# EasyEDA Pro project TI.epro

# Schematic Schematic6
Board Name: 28335底板; Create Date: 2026-03-09; Page Name: P1; Project Name: 最小系统板28335; Schematic Name: Schematic6; Update Date: 2026-07-10; Company: 嘉立创EDA; Page Size: A4; Version: V1.0
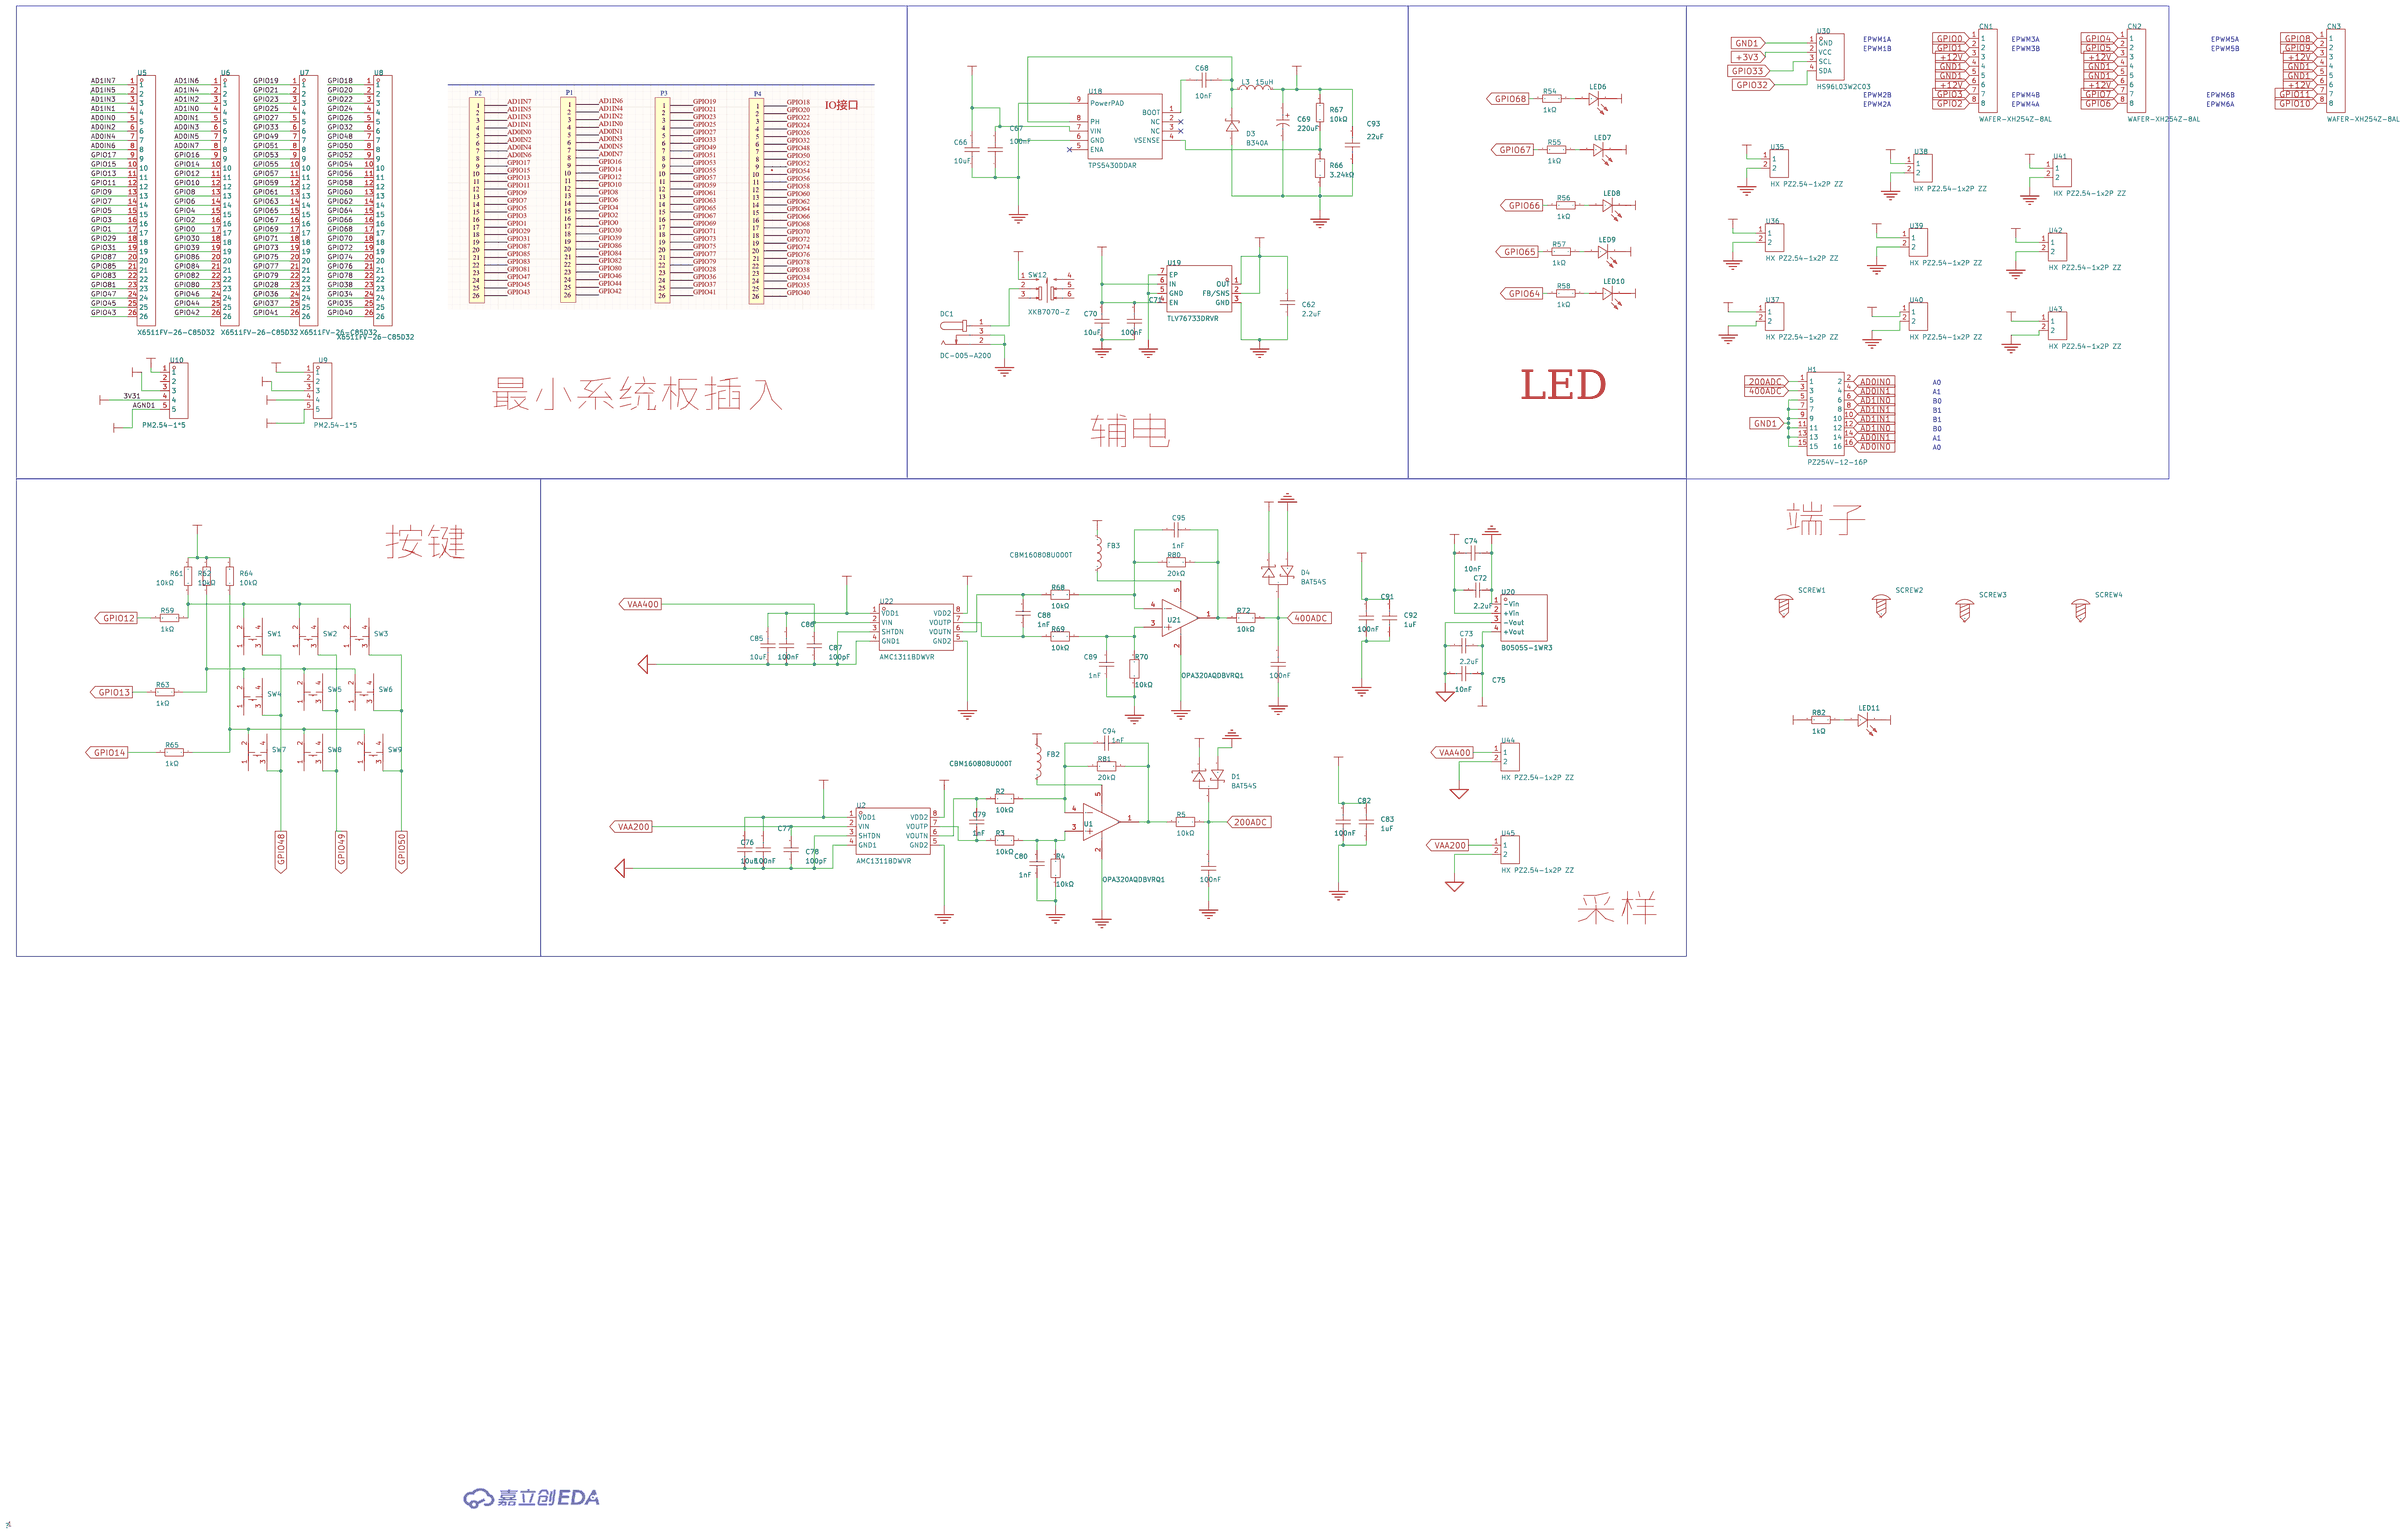
[diagram p0: schematic sheet]

## Parts
C62  2.2uF  [C0603]
C66  10uF  [C0603]
C67  100nF  [C0603]
C68  10nF  [C0603]
C69  220uF  [CAP-SMD_BD6.3-L6.6-W6.6-FD]
C70  10uF  [C0603]
C71  100nF  [C0603]
C72  2.2uF  [C0603]
C73  2.2uF  [C0603]
C74  10nF  [C0603]
C75  10nF  [C0603]
C76  10uF  [C0603]
C77  100nF  [C0603]
C78  100pF  [C0603]
C79  1nF  [C0603]
C80  1nF  [C0603]
C81  100nF  [C0603]
C82  100nF  [C0603]
C83  1uF  [C0603]
C85  10uF  [C0603]
C86  100nF  [C0603]
C87  100pF  [C0603]
C88  1nF  [C0603]
C89  1nF  [C0603]
C90  100nF  [C0603]
C91  100nF  [C0603]
C92  1uF  [C0603]
C93  22uF  [C0805]
C94  1nF  [C0603]
C95  1nF  [C0603]
CN1  WAFER-XH254Z-8AL  [CONN-TH_WAFER-XH254Z-8A]
CN2  WAFER-XH254Z-8AL  [CONN-TH_WAFER-XH254Z-8A]
CN3  WAFER-XH254Z-8AL  [CONN-TH_WAFER-XH254Z-8A]
D1  BAT54S  [SOT-23-3_L2.9-W1.3-P1.90-LS2.4-BR]
D3  B340A  [SMA_L4.3-W2.6-LS5.1-RD]
D4  BAT54S  [SOT-23-3_L2.9-W1.3-P1.90-LS2.4-BR]
DC1  DC-005-A200  [DC-IN-TH_DC-005-A200]
FB2  CBM160808U000T  [L0603]
FB3  CBM160808U000T  [L0603]
H1  PZ254V-12-16P  [HDR-TH_16P-P2.54-V-M-R2-C8-S2.54]
L3  15uH  [IND-SMD_L7.3-W6.8]
LED6  NCD0805R1  [LED0805-R-RD]
LED7  NCD0805R1  [LED0805-R-RD]
LED8  NCD0805R1  [LED0805-R-RD]
LED9  NCD0805R1  [LED0805-R-RD]
LED10  NCD0805R1  [LED0805-R-RD]
LED11  NCD0805R1  [LED0805-R-RD]
R2  10kΩ  [R0603]
R3  10kΩ  [R0603]
R4  10kΩ  [R0603]
R5  10kΩ  [R0603]
R54  1kΩ  [R0603]
R55  1kΩ  [R0603]
R56  1kΩ  [R0603]
R57  1kΩ  [R0603]
R58  1kΩ  [R0603]
R59  1kΩ  [R0603]
R61  10kΩ  [R0603]
R62  10kΩ  [R0603]
R63  1kΩ  [R0603]
R64  10kΩ  [R0603]
R65  1kΩ  [R0603]
R66  3.24kΩ  [R0603]
R67  10kΩ  [R0603]
R68  10kΩ  [R0603]
R69  10kΩ  [R0603]
R70  10kΩ  [R0603]
R72  10kΩ  [R0603]
R80  20kΩ  [R0603]
R81  20kΩ  [R0603]
R82  1kΩ  [R0603]
SCREW1  -  [M4螺丝]
SCREW2  -  [M4螺丝]
SCREW3  -  [M4螺丝]
SCREW4  -  [M4螺丝]
SW1  TS-1095-A10B3-D1  [SW-TH_4P-L6.0-W6.0-P4.50-LS6.5]
SW2  TS-1095-A10B3-D1  [SW-TH_4P-L6.0-W6.0-P4.50-LS6.5]
SW3  TS-1095-A10B3-D1  [SW-TH_4P-L6.0-W6.0-P4.50-LS6.5]
SW4  TS-1095-A10B3-D1  [SW-TH_4P-L6.0-W6.0-P4.50-LS6.5]
SW5  TS-1095-A10B3-D1  [SW-TH_4P-L6.0-W6.0-P4.50-LS6.5]
SW6  TS-1095-A10B3-D1  [SW-TH_4P-L6.0-W6.0-P4.50-LS6.5]
SW7  TS-1095-A10B3-D1  [SW-TH_4P-L6.0-W6.0-P4.50-LS6.5]
SW8  TS-1095-A10B3-D1  [SW-TH_4P-L6.0-W6.0-P4.50-LS6.5]
SW9  TS-1095-A10B3-D1  [SW-TH_4P-L6.0-W6.0-P4.50-LS6.5]
SW12  XKB7070-Z  [SW-TH_6P-L7.0-W7.0-P2.00]
U1  OPA320AQDBVRQ1  [SOT-23-5_L2.9-W1.6-P0.95-LS2.8-BR]
U2  AMC1311BDWVR  [SOIC-8_L7.5-W5.9-P1.27-LS11.5-BL]
U5  X6511FV-26-C85D32  [HDR-TH_26P-P2.54-V-F]
U6  X6511FV-26-C85D32  [HDR-TH_26P-P2.54-V-F]
U7  X6511FV-26-C85D32  [HDR-TH_26P-P2.54-V-F]
U8  X6511FV-26-C85D32  [HDR-TH_26P-P2.54-V-F]
U9  PM2.54-1*5  [HDR-TH_5P-P2.54-V-F]
U10  PM2.54-1*5  [HDR-TH_5P-P2.54-V-F]
U18  TPS5430DDAR  [ESOP-8_L4.9-W3.9-P1.27-LS6.0-TL-EP]
U19  TLV76733DRVR  [WSON-6_L2.0-W2.0-P0.65-TL-EP]
U20  B0505S-1WR3  [PWRM-TH_B0505S-1WR3]
U21  OPA320AQDBVRQ1  [SOT-23-5_L2.9-W1.6-P0.95-LS2.8-BR]
U22  AMC1311BDWVR  [SOIC-8_L7.5-W5.9-P1.27-LS11.5-BL]
U30  HS96L03W2C03  [OLED-TH_L27.8-W27.2-P2.54_C9900033791]
U35  HX PZ2.54-1x2P ZZ  [HDR-TH_2P-P2.54-V-M-3]
U36  HX PZ2.54-1x2P ZZ  [HDR-TH_2P-P2.54-V-M-3]
U37  HX PZ2.54-1x2P ZZ  [HDR-TH_2P-P2.54-V-M-3]
U38  HX PZ2.54-1x2P ZZ  [HDR-TH_2P-P2.54-V-M-3]
U39  HX PZ2.54-1x2P ZZ  [HDR-TH_2P-P2.54-V-M-3]
U40  HX PZ2.54-1x2P ZZ  [HDR-TH_2P-P2.54-V-M-3]
U41  HX PZ2.54-1x2P ZZ  [HDR-TH_2P-P2.54-V-M-3]
U42  HX PZ2.54-1x2P ZZ  [HDR-TH_2P-P2.54-V-M-3]
U43  HX PZ2.54-1x2P ZZ  [HDR-TH_2P-P2.54-V-M-3]
U44  HX PZ2.54-1x2P ZZ  [HDR-TH_2P-P2.54-V-M-3]
U45  HX PZ2.54-1x2P ZZ  [HDR-TH_2P-P2.54-V-M-3]

## Library data of the parts
C62 C72 C73 = CL10A225KO8NNNC: 容值:2.2uF;精度:±10%;额定电压:16V;材质(温度系数):X5R;; LCSC Part Name: 2.2uF ±10% 16V; Supplier Part: C23630; Manufacturer: SAMSUNG(三星); Supplier Footprint: 0603; Datasheet: https://atta.szlcsc.com/upload/public/pdf/source/20160218/1457707763339.pdf; Supplier: LCSC; Tolerance: ±10%; Voltage Rated: 16V; Temperature Coefficient: X5R
C66 C70 C76 C85 = CL10A106KO8NQNC: 容值:10uF;精度:±10%;额定电压:16V;温度系数:X5R;; LCSC Part Name: 10uF ±10% 16V; Supplier Part: C962136; Manufacturer: SAMSUNG(三星); Supplier Footprint: 0603; JLCPCB Part Class: 扩展库; Datasheet: https://item.szlcsc.com/datasheet/CL10A106KO8NQNC/1043176.html; Supplier: LCSC; Tolerance: ±10%; Voltage Rating: 16V; Temperature Coefficient: X5R
C67 C71 C77 C81 C82 C86 C90 C91 = CC0603KRX7R7BB104: 容值:100nF;精度:±10%;额定电压:16V;温度系数:X7R;; LCSC Part Name: 100nF ±10% 16V; Supplier Part: C108079; Manufacturer: YAGEO(国巨); Supplier Footprint: 0603; JLCPCB Part Class: 扩展库; Datasheet: https://item.szlcsc.com/datasheet/CC0603KRX7R7BB104/109298.html; Supplier: LCSC; Tolerance: ±10%; Voltage Rating: 16V; Temperature Coefficient: X7R
C68 C74 C75 = CC0603KRX7R7BB103: 容值:10nF;精度:±10%;额定电压:16V;温度系数:X7R;; LCSC Part Name: 10nF ±10% 16V; Supplier Part: C519406; Manufacturer: YAGEO(国巨); Supplier Footprint: 0603; JLCPCB Part Class: 扩展库; Datasheet: https://item.szlcsc.com/datasheet/CC0603KRX7R7BB103/536077.html; Supplier: LCSC; Tolerance: ±10%; Voltage Rating: 16V; Temperature Coefficient: X7R
C69 = RST220UF16V167RV0019: 容值:220uF;精度:±20%;额定电压:16V;纹波电流:95mA@120Hz;等效串联电阻(ESR):-;; LCSC Part Name: 220uF ±20% 16V; Supplier Part: C5138966; Manufacturer: KNSCHA(科尼盛); Supplier Footprint: SMD,D6.3xL7.7mm; JLCPCB Part Class: 扩展库; Datasheet: https://atta.szlcsc.com/upload/public/pdf/source/20220823/9606934187E91363EC0A73EA8F897094.pdf; Supplier: LCSC; Tolerance: ±20%; Voltage Rating: 16V; Ripple Current: 95mA@120Hz; Diameter: 6.3mm; Height - Seated (Max): 7.7mm; Lifetime: 2000hrs@105℃; Operating Temperature: -40℃~+105℃
C78 C87 = CC0603KRX7R9BB101: 容值:100pF;精度:±10%;额定电压:50V;温度系数:X7R;; LCSC Part Name: 100pF ±10% 50V; Supplier Part: C160903; Manufacturer: YAGEO(国巨); Supplier Footprint: 0603; JLCPCB Part Class: 扩展库; Datasheet: https://item.szlcsc.com/datasheet/CC0603KRX7R9BB101/172284.html; Supplier: LCSC; Tolerance: ±10%; Voltage Rating: 50V; Temperature Coefficient: X7R
C79 C80 C88 C89 C94 C95 = CL10B102KB8NNNC: 容值:1nF;精度:±10%;额定电压:50V;温度系数:X7R;; LCSC Part Name: 1nF ±10% 50V; Supplier Part: C1588; Manufacturer: SAMSUNG(三星); Supplier Footprint: 0603; JLCPCB Part Class: 基础库; Datasheet: https://item.szlcsc.com/datasheet/CL10B102KB8NNNC/1940.html; Supplier: LCSC; Tolerance: ±10%; Voltage Rating: 50V; Temperature Coefficient: X7R
C83 C92 = CL10A105KB8NNNC: 容值:1uF;精度:±10%;额定电压:50V;温度系数:X5R;; LCSC Part Name: 1uF ±10% 50V; Supplier Part: C15849; Manufacturer: SAMSUNG(三星); Supplier Footprint: 0603; JLCPCB Part Class: 基础库; Datasheet: https://item.szlcsc.com/datasheet/CL10A105KB8NNNC/16531.html; Supplier: LCSC; Tolerance: ±10%; Voltage Rating: 50V; Temperature Coefficient: X5R
C93 = CL21A226KOQNNNE: 容值:22uF;精度:±10%;额定电压:16V;温度系数:X5R;; LCSC Part Name: 22uF ±10% 16V; Supplier Part: C296720; Manufacturer: SAMSUNG(三星); Supplier Footprint: 0805; JLCPCB Part Class: 扩展库; Datasheet: https://item.szlcsc.com/datasheet/CL21A226KOQNNNE/280885.html; Supplier: LCSC; Tolerance: ±10%; Voltage Rating: 16V; Temperature Coefficient: X5R
CN1-CN3 = WAFER-XH254Z-8AL: 插针结构:1x8P;间距:2.54mm;安装方式:直插;参考系列:XH;总PIN数:8P;排数:1;每排PIN数:8;额定电流:3A;触头材质:黄铜;工作温度:-25℃~+85℃;; LCSC Part Name: 1x8P 间距:2.54mm 直插 系列:XH; Supplier Part: C22751801; Manufacturer: HANBO(汉博); Supplier Footprint: 插件,P=2.54mm; JLCPCB Part Class: 扩展库; Datasheet: https://item.szlcsc.com/datasheet/WAFER-XH254Z-8AL/24478736.html; Supplier: LCSC; Pins Structure: 1x8P; Pitch: 2.54mm; Mounting Type: 直插; Reference Series: XH; Number of Pins: 8P; Number of Rows: 1; Number of PINs Per Row: 8; Current Rating: 3A; Contact Material: 黄铜; Operating Temperature: -25℃~+85℃; Voltage Rating: 250V; Plastic Material: PA66; Flame Retardant Rating: UL94V-0
D1 D4 = BAT54S_C7420333: 二极管配置:1对串联式;正向压降(Vf):400mV@10mA;直流反向耐压(Vr):30V;整流电流:200mA;; LCSC Part Name: 电压:30V 电流:200mA; Supplier Part: C7420333; Manufacturer: 宏嘉诚; Supplier Footprint: SOT-23; JLCPCB Part Class: 扩展库; Datasheet: https://atta.szlcsc.com/upload/public/pdf/source/20250121/A263DE00CCBA17D340DF4D7850190654.pdf; Supplier: LCSC; Diode Configuration: 1对串联式; Voltage - Forward(Vf@If): 400mV@10mA; Voltage - DC Reverse(Vr): 30V; Current - Rectified: 200mA; Reverse Leakage Current (Ir): 2uA@30V
D3 = B340A: 二极管配置:独立式;正向压降(Vf):550mV@3A;直流反向耐压(Vr):40V;整流电流:3A;; LCSC Part Name: 电压:40V 电流:3A; Supplier Part: C64982; Manufacturer: MDD(辰达半导体); Supplier Footprint: SMA(DO-214AC); JLCPCB Part Class: 扩展库; Datasheet: https://atta.szlcsc.com/upload/public/pdf/source/20240710/591710C3B34CDB7FE3DA92C119E6F598.pdf; Supplier: LCSC; Diode Configuration: 独立式; Forward Voltage (Vf@If): 550mV@3A; Reverse Voltage (Vr): 40V; Rectified Current: 3A; Reverse Leakage Current (Ir): 500uA@40V
DC1 = DC-005-A200: 连接器类型:DC电源插座;安装方式:弯插;触点内径:2mm;触点外径:6.4mm;额定电流:3A;额定电压:30V;工作温度:-20℃~+70℃;; LCSC Part Name: DC电源插座 内径:2mm 外径:6.4mm; Supplier Part: C720557; Manufacturer: XUNPU(讯普); Supplier Footprint: 插件; JLCPCB Part Class: 扩展库; Datasheet: https://item.szlcsc.com/datasheet/DC-005-A200/763564.html; Supplier: LCSC; Connector Type: DC电源插座; Mounting Type: 弯插; Inside Contact Diameter: 2mm; Outside Contact Diameter: 6.4mm; Current Rating: 3A; Voltage Rating (Max): 30V; Operating Temperature: -20℃~+70℃
FB2 FB3 = CBM160808U000T: 阻抗@频率:0Ω@100MHz;直流电阻(DCR):10mΩ;; LCSC Part Name: 单路 0603磁珠 阻抗0Ω@100MHz; Supplier Part: C394410; Manufacturer: FH(风华); Supplier Footprint: 0603; JLCPCB Part Class: 扩展库; Datasheet: https://item.szlcsc.com/datasheet/CBM160808U000T/373685.html; Supplier: LCSC; Impedance @ Frequency: 0Ω@100MHz; DC Resistance(DCR): 10mΩ; Current Rating: 6A; Number of Circuits: 1; Operating Temperature: -55℃~+125℃
H1 = PZ254V-12-16P: 插针结构:2x8P;间距:2.54mm;行距:2.54mm;圆针/方针:方针;安装方式:直插;排数:双排;总PIN位数:16P;额定电流:-;额定电压:-;配合针长度:6mm;塑高:2.5mm;端接针长度:3mm;触头材质:黄铜;触头镀层:-;工作温度:-40℃~+105℃;颜色:黑色;; LCSC Part Name: 2x8P 间距:2.54mm 方针 直插; Supplier Part: C492425; Manufacturer: XFCN(兴飞); Supplier Footprint: 插件,P=2.54mm; JLCPCB Part Class: 扩展库; Datasheet: https://item.szlcsc.com/datasheet/PZ254V-12-16P/502981.html; Supplier: LCSC; Pin Structure: 2x8P; Pitch: 2.54mm; Row Spacing: 2.54mm; Circluar Pins/Square Pins: 方针; Mounting Type: 直插; Number of Rows: 双排; Number of Pins: 16P; Length of Mating Pin: 6mm; Insulation Height: 2.5mm; Length of End Connection Pin: 3mm; Contact Material: 黄铜; Operating Temperature: -40℃~+105℃; Color: 黑色
L3 = MWSA0603S-150MT: 精度:±20%;额定电流:3A;电感值:15uH;直流电阻(DCR):113mΩ;; LCSC Part Name: 15uH±20%; Supplier Part: C408452; Manufacturer: Sunlord(顺络); Supplier Footprint: SMD; JLCPCB Part Class: ExtendedPart; Datasheet: https://atta.szlcsc.com/upload/public/pdf/source/20190729/C408452_7F0A9CFF0AB8A0D8AD496F52F1F29DF7.pdf; Supplier: LCSC; Width: 7mm; Tolerance: ±20%; Length: 6.6mm; Height: 3mm; Rated Current: 3A; DC Resistance (DCR): 113mΩ
LED6-LED11 = NCD0805R1: 灯头类型:-;发光颜色:红色;正向电压(VF):1.6V~2.6V;功率:65mW;正向电流:20mA;主波长:615nm~630nm;二极管配置:独立二极管;透镜颜色:无色透明透镜;色温:-;发光强度:67mcd~195mcd;发光角度:130°;载带方式:-;工作温度:-30℃~+85℃;; Supplier Part: C84256; Manufacturer: 国星光电; Supplier Footprint: 0805; JLCPCB Part Class: 基础库; Datasheet: https://atta.szlcsc.com/upload/public/pdf/source/20200820/C84256_F0A75A43B3EAD75808600A0514C76B99.pdf; Supplier: LCSC; Emitted Color: 红色; Forward Voltage (VF): 1.6V~2.6V; Power Dissipation: 65mW; Forward Current: 20mA; Dominant Wavelength: 615nm~630nm; Diode Configuration: 独立二极管; Lens Color: 无色透明透镜; Luminous Intensity: 67mcd~195mcd; Viewing Angle: 130°; Operating Temperature: -30℃~+85℃
R2-R5 R68-R70 R72 = RT0603BRD074R7L: 电阻类型:薄膜电阻;阻值:4.7Ω;精度:±0.1%;功率:100mW;温度系数:±25ppm/℃;; LCSC Part Name: 薄膜电阻 4.7Ω ±0.1% 100mW; Supplier Part: C861448; Manufacturer: YAGEO(国巨); Supplier Footprint: 0603; JLCPCB Part Class: 扩展库; Datasheet: https://atta.szlcsc.com/upload/public/pdf/source/20200610/C326738_5639A9F1B6EB6E4AE2197577D3456E7F.pdf; Supplier: LCSC; Type: 薄膜电阻; Tolerance: ±0.1%; Power(Watts): 100mW; Temperature Coefficient: ±25ppm/℃; Operating Temperature: -55℃~+155℃
R54-R59 R63 R65 R82 = 0603WAF1001T5E: 电阻类型:厚膜电阻;阻值:1kΩ;精度:±1%;功率:100mW;最大工作电压:75V;温度系数:±100ppm/℃;; LCSC Part Name: 1kΩ ±1% 100mW 厚膜电阻; Supplier Part: C21190; Manufacturer: UNI-ROYAL(厚声); Supplier Footprint: 0603; Datasheet: https://atta.szlcsc.com/upload/public/pdf/source/20200306/C422600_1E6D84923E4A46A82E41ADD87F860B5C.pdf; Supplier: LCSC; Type: 厚膜电阻; Tolerance: ±1%; Power(Watts): 100mW; Overload Voltage (Max): 75V; Temperature Coefficient: ±100ppm/℃; Operating Temperature Range: -55℃~+155℃
R61 R62 R64 R67 = 0603WAF1002T5E: 电阻类型:厚膜电阻;阻值:10kΩ;精度:±1%;功率:100mW;工作电压:75V;温度系数:±100ppm/℃;; LCSC Part Name: 厚膜电阻 10kΩ ±1% 100mW; Supplier Part: C25804; Manufacturer: UNI-ROYAL(厚声); Supplier Footprint: 0603; JLCPCB Part Class: 基础库; Datasheet: https://atta.szlcsc.com/upload/public/pdf/source/20200306/C422600_1E6D84923E4A46A82E41ADD87F860B5C.pdf; Supplier: LCSC; Type: 厚膜电阻; Tolerance: ±1%; Power(Watts): 100mW; Voltage-Supply(Max): 75V; Temperature Coefficient: ±100ppm/℃; Operating Temperature: -55℃~+155℃
R66 = RT0603BRD073K24L: 电阻类型:薄膜电阻;阻值:3.24kΩ;精度:±0.1%;功率:100mW;温度系数:±25ppm/℃;; LCSC Part Name: 薄膜电阻 3.24kΩ ±0.1% 100mW; Supplier Part: C728589; Manufacturer: YAGEO(国巨); Supplier Footprint: 0603; JLCPCB Part Class: 扩展库; Datasheet: https://atta.szlcsc.com/upload/public/pdf/source/20200814/C723483_9C38DBFE9BAEFED0FBB9716EAA9FF07C.pdf; Supplier: LCSC; Type: 薄膜电阻; Tolerance: ±0.1%; Power(Watts): 100mW; Temperature Coefficient: ±25ppm/℃; Operating Temperature Range: -55℃~+155℃
R80 R81 = RT0603BRD0720KL: 电阻类型:薄膜电阻;阻值:20kΩ;精度:±0.1%;功率:100mW;工作电压:75V;温度系数:±25ppm/℃;; LCSC Part Name: 薄膜电阻 20kΩ ±0.1% 100mW; Supplier Part: C723637; Manufacturer: YAGEO(国巨); Supplier Footprint: 0603; JLCPCB Part Class: 扩展库; Datasheet: https://item.szlcsc.com/datasheet/RT0603BRD0720KL/768328.html; Supplier: LCSC; Type: 薄膜电阻; Tolerance: ±0.1%; Power(Watts): 100mW; Voltage-Supply(Max): 75V; Temperature Coefficient: ±25ppm/℃; Operating Temperature: -55℃~+155℃
SCREW1-SCREW4 = M4螺丝: Supplier Footprint: 插件
SW1-SW9 = TS-1095-A10B3-D1: 电路结构:单刀单掷;按钮形状:圆形按钮;作用力:2.5N;安装方式:-;开关长度:6mm;开关宽度:6mm;开关高度:8.5mm;带灯:-;工作寿命:-;; LCSC Part Name: 轻触开关6*6*8.5mm插件四脚DIP圆柄黑柄250gf; Supplier Part: C493052; Manufacturer: Yuandi(元迪); Supplier Footprint: 插件-4P,6x6mm; JLCPCB Part Class: 扩展库; Datasheet: https://item.szlcsc.com/datasheet/TS-1095-A10B3-D1/503682.html; Supplier: LCSC; Circuit: 单刀单掷; Actuator Style: 圆形按钮; Operating Force: 2.5N; Length: 6mm; Width: 6mm; Switch Height: 8.5mm
SW12 = XKB7070-Z: 自锁/无锁:自锁;安装方式:直插;触点电流:100mA;额定电压:30V;带灯:不带;作用力:1.6N;工作寿命:10万次;; LCSC Part Name: 按键开关   7*7插件自锁 蓝白黑; Supplier Part: C318863; Manufacturer: XKB Connection(中国星坤); Supplier Footprint: 插件; JLCPCB Part Class: 扩展库; Datasheet: https://item.szlcsc.com/datasheet/XKB7070-Z/299955.html; Supplier: LCSC; Self Lock / No Lock: 自锁; Actuator Style: 矩形按钮; Mounting Type: 直插; Contact Current: 100mA; Voltage Rating: 30V; Actuator/Cap Color: 蓝色; With Lamp: 不带; Termination Style: PC引脚; Operating Force: 1.6N; Operating Temperature: -15℃~+55℃; Life: 10万次
U1 U21 = OPA320AQDBVRQ1: 放大器数:单路;增益带宽积(GBP):20MHz;输入偏置电流(Ib):0.2pA;压摆率(SR):10V/us;带宽(-3db):-;轨到轨:-;; Supplier Part: C2058253; Manufacturer: TI(德州仪器); Supplier Footprint: SOT-23-5; JLCPCB Part Class: 扩展库; Datasheet: https://www.ti.com/cn/lit/gpn/opa320-q1; Supplier: LCSC; Number of Circuits: 单路; Gain Bandwidth Product(GBP): 20MHz; Current - Input Bias(Ib): 0.2pA; Slew Rate(SR): 10V/us; Output Current: 65mA; Operating Temperature: -40℃~+125℃
U2 U22 = AMC1311BDWVR: AMC1311 2V 输入、精密电压检测增强型隔离式放大器; Supplier Part: C783598; Manufacturer: TI(德州仪器); Supplier Footprint: SOIC-8-300mil; JLCPCB Part Class: 扩展库; Datasheet: https://www.ti.com/cn/lit/gpn/amc1311; Supplier: LCSC
U5-U8 = X6511FV-26-C85D32: 插孔结构:1x26P;间距:2.54mm;行距:-;圆孔/方孔:方孔;安装类型:直插;排数:单排;总孔位数:26P;额定电流:3A;额定电压:250V;插孔方向:顶部;塑高:8.5mm;触头材质:黄铜;触头镀层:金;工作温度范围:-40℃~+105℃;焊接温度(最大值):260℃;; LCSC Part Name: 间距:2.54mm 1x26P 直插; Supplier Part: C2883743; Manufacturer: XKB Connection(中国星坤); Supplier Footprint: 插件,P=2.54mm; JLCPCB Part Class: 扩展库; Datasheet: https://atta.szlcsc.com/upload/public/pdf/source/20211009/E31A179D77B4765F9C2936200B697B47.pdf; Supplier: LCSC; Holes Structure: 1x26P; Pitch: 2.54mm; Circular Hole / Square Hole: 方孔; Mounting Type: 直插; Number of Rows: 单排; Number of Holes: 26P; Current Rating (Max): 3A; Voltage Rating (Max): 250V; Holes Direction: 顶部; Insulation Height: 8.5mm; Contact Material: 黄铜; Contact Plating: 金; Operating Temperature Range: -40℃~+105℃; Soldering Temperature(Max): 260℃
U9 U10 = PM2.54-1*5: 插孔结构:1x5P;间距:2.54mm;行距:2.54mm;圆孔/方孔:方孔;安装类型:直插;排数:单排;总孔位数:5P;额定电流:2.5A;插孔方向:顶部;塑高:8.5mm;工作温度范围:-40℃~+105℃;; LCSC Part Name: 间距:2.54mm 1x5P 直插; Supplier Part: C5116488; Manufacturer: ZHOURI(洲日); Supplier Footprint: 插件,P=2.54mm; Datasheet: https://atta.szlcsc.com/upload/public/pdf/source/20220803/9CD49C6F5EDF44A82395C8C3734B0185.pdf; Supplier: LCSC; Holes Structure: 1x5P; Pitch: 2.54mm; Row Spacing: 2.54mm; Circular Hole / Square Hole: 方孔; Mounting Type: 直插; Number of Rows: 单排; Number of Holes: 5P; Current Rating (Max): 2.5A; Holes Direction: 顶部; Insulation Height: 8.5mm; Operating Temperature Range: -40℃~+105℃
U18 = TPS5430DDAR: 功能类型:降压型;输出类型:可调;工作电压:5.5V~36V;输出电压:1.221V~32.04V;输出电流:3A;; LCSC Part Name: 宽输入范围、3A输出电流的降压转换器; Supplier Part: C9864; Manufacturer: TI(德州仪器); Supplier Footprint: SOIC-8-EP; JLCPCB Part Class: 基础库; Datasheet: https://www.ti.com/cn/lit/gpn/tps5430; Supplier: LCSC; Function: 降压型; Output Type: 可调; Input Voltage: 5.5V~36V; Output Voltage: 1.221V~32.04V; Output Current: 3A; Switching Frequency: 500kHz; Operating Temperature: -40℃~+125℃@(TJ); Synchronous Rectification: 否; Number of Outputs: 1; Topology: 降压式; Switch tube (built-in/external): 内置
U19 = TLV76733DRVR: 输出类型:固定;最大输入电压:16V;输出电压:3.3V;输出电流:1A;电源纹波抑制比(PSRR):70dB@(120Hz);输出极性:正极;; LCSC Part Name: 具有可调节输出和固定输出的 1A、16V 正电压低压降 (LDO) 线性稳压器; Supplier Part: C2848334; Manufacturer: TI(德州仪器); Supplier Footprint: WSON-6(2x2); JLCPCB Part Class: 扩展库; Datasheet: https://www.ti.com/cn/lit/gpn/tlv767; Supplier: LCSC; Output Type: 固定; Maximum Input Voltage: 16V; Output Voltage: 3.3V; Output Current: 1A; Power Supply Rejection Ratio (PSRR): 70dB@(120Hz); Dropout Voltage: 1.4V@(1A); standby current: 80uA; Feature: 防静电保护；软启动；浪涌保护；低ESR；热保护(TSD)；欠压闭锁；过流保护(OCP)；带使能；防倒灌; Operating Temperature: -40℃~+125℃@(Tj); Output Polarity: 正极; Number of Outputs: 1
U20 = B0505S-1WR3_C7465178: B0505S-1WR3型号是定电压输入,隔离非稳压单路输出的DC/DC模块电源产品；输入电压5V(4.5V~5.5V)，输出电压5Vdc，输出电流200mA，输出功率1W;转换效率86%;低静态电流，低纹波系数和低噪音，超低功耗;输出可持续短路保护，自恢复;最大容性负载2400uF;适用于纯数字电路，一般低频模拟电路，继电器驱动电路，数据交换电路等 ;输入输出隔离耐压1.5KVdc ;尺寸：长11.68*高10.16*宽6.00mm; LCSC Part Name: DC-DC输入5V输出5V200mA 1W输出短路保护; Supplier Part: C7465178; Manufacturer: EVISUN(易成); Supplier Footprint: SIP,11.7x6mm; JLCPCB Part Class: 扩展库; Datasheet: https://item.szlcsc.com/datasheet/B0505S-1WR3/8505845.html; Supplier: LCSC; Output Power: 1W; Voltage - Supply: 4.5V~5.5V; Conversion Efficiency: 86%; Output Voltage: 5V; Output Current(Max): 200mA; Capacitive Load(Max): 2400uF; Isolation Voltage(Vrms): 1.5kV; Features: 短路保护
U30 = HS96L03W2C03: 核心芯片:SSD1315芯片;接口类型:I2C;尺寸(inch):0.96;像素分辨率:128x64;; LCSC Part Name: 0.96寸OLED显示屏窄白光IIC; Supplier Part: C5248080; Manufacturer: HS(汉昇); JLCPCB Part Class: 扩展库; Datasheet: https://item.szlcsc.com/datasheet/HS96L03W2C03/5960631.html; Supplier: LCSC; Controller Type: SSD1315芯片; Interface: I2C; Size: 0.96; Dot Pixels: 128x64; Operating Temperature: -40℃~+70℃; Type of Drive: 无源(PMOLED); Display Range: 21.744x10.864mm; Display Color: 白色; Voltage - Supply: 2.8V~3.3V; Luminance: 180cd/m2
U35-U45 = HX PZ2.54-1x2P ZZ: 插针结构:1x2P;间距:2.54mm;行距:-;圆针/方针:方针;安装方式:直插;排数:单排;总PIN位数:2P;额定电流:3A;额定电压:1kV;配合针长度:6mm;塑高:2.5mm;端接针长度:3mm;触头材质:黄铜;触头镀层:金;工作温度:-40℃~+105℃;颜色:黑色;; LCSC Part Name: 1x2P 间距:2.54mm 方针 直插; Supplier Part: C32713268; Manufacturer: hanxia(韩下); Supplier Footprint: 插件,P=2.54mm; JLCPCB Part Class: 扩展库; Datasheet: https://item.szlcsc.com/datasheet/HX%2520PZ2.54-1x2P%2520ZZ/34444548.html; Supplier: LCSC; Pin Structure: 1x2P; Pitch: 2.54mm; Circluar Pins/Square Pins: 方针; Mounting Type: 直插; Number of Rows: 单排; Number of Pins: 2P; Current Rating: 3A; Voltage Rating (Max): 1kV; Length of Mating Pin: 6mm; Insulation Height: 2.5mm; Length of End Connection Pin: 3mm; Contact Material: 黄铜; Contact Plating: 金; Operating Temperature: -40℃~+105℃; Color: 黑色

## Nets
3V31: U10.4
3V32: U9.4
5V1: C69.1 C70.2 C71.2 C72.2 C74.2 C82.2 C83.2 C91.2 C92.2 C93.2 FB2.1 FB3.1 L3.2 R67.2 R82.2 U2.8(VDD2) U10.1 U19.4(EN) U19.6(IN) U20.2(+Vin) U22.8(VDD2) U36.1 U39.1 U42.1
5V2: U9.1
+3V3: C62.2 D1.2(K2) D4.2(K2) R61.2 R62.2 R64.2 U19.1(OUT) U19.2(FB/SNS) U30.2(VCC) U37.1 U40.1 U43.1
+5VA: C73.1 C75.2 C76.2 C77.2 C85.2 C86.2 U2.1(VDD1) U20.4(+Vout) U22.1(VDD1)
+12V: C66.2 C67.2 CN1.3 CN1.6 CN2.3 CN2.6 CN3.3 CN3.6 SW12.1 U18.7(VIN) U35.1 U38.1 U41.1
AGND: C73.2 C75.1 C76.1 C77.1 C78.1 C85.1 C86.1 C87.1 U2.3(SHTDN) U2.4(GND1) U20.3(-Vout) U22.3(SHTDN) U22.4(GND1) U44.2 U45.2
AGND1: C72.1 C74.1 C80.1 C81.1 C82.1 C83.1 C89.1 C90.1 C91.1 C92.1 R4.1 R70.1 U1.2(V-) U2.5(GND2) U10.5 U20.1(-Vin) U21.2(V-) U22.5(GND2)
AGND2: U9.5
GND1: C62.1 C66.1 C67.1 C69.2 C70.1 C71.1 C93.1 CN1.4 CN1.5 CN2.4 CN2.5 CN3.4 CN3.5 D1.1(K1) D3.2(A) D4.1(K1) DC1.2 DC1.3 H1.5 H1.7 H1.9 H1.11 H1.13 H1.15 LED6.2(-) LED7.2(-) LED8.2(-) LED9.2(-) LED10.2(-) LED11.2(-) R66.1 U10.3 U18.6(GND) U18.9(PowerPAD) U19.3(GND) U19.5(GND) U19.7(EP) U30.1(GND) U35.2 U36.2 U37.2 U38.2 U39.2 U40.2 U41.2 U42.2 U43.2
GND2: U9.3
200ADC: C81.2 D1.3(A) H1.1 R5.1
400ADC: C90.2 D4.3(A) H1.3 R72.1
AD0IN0: H1.2 H1.16 U5.5
AD0IN1: H1.4 H1.14 U6.5
AD0IN2: U5.6
AD0IN3: U6.6
AD0IN4: U5.7
AD0IN5: U6.7
AD0IN6: U5.8
AD0IN7: U6.8
AD1IN0: H1.6 H1.12 U6.4
AD1IN1: H1.8 H1.10 U5.4
AD1IN2: U6.3
AD1IN3: U5.3
AD1IN4: U6.2
AD1IN5: U5.2
AD1IN6: U6.1
AD1IN7: U5.1
GPIO0: CN1.1 U6.17
GPIO1: CN1.2 U5.17
GPIO2: CN1.8 U6.16
GPIO3: CN1.7 U5.16
GPIO4: CN2.1 U6.15
GPIO5: CN2.2 U5.15
GPIO6: CN2.8 U6.14
GPIO7: CN2.7 U5.14
GPIO8: CN3.1 U6.13
GPIO9: CN3.2 U5.13
GPIO10: CN3.8 U6.12
GPIO11: CN3.7 U5.12
GPIO12: R59.2 U6.11
GPIO13: R63.2 U5.11
GPIO14: R65.2 U6.10
GPIO15: U5.10
GPIO16: U6.9
GPIO17: U5.9
GPIO18: U8.1
GPIO19: U7.1
GPIO20: U8.2
GPIO21: U7.2
GPIO22: U8.3
GPIO23: U7.3
GPIO24: U8.4
GPIO25: U7.4
GPIO26: U8.5
GPIO27: U7.5
GPIO28: U7.23
GPIO29: U5.18
GPIO30: U6.18
GPIO31: U5.19
GPIO32: U8.6 U30.4(SDA)
GPIO33: U7.6 U30.3(SCL)
GPIO34: U8.24
GPIO35: U8.25
GPIO36: U7.24
GPIO37: U7.25
GPIO38: U8.23
GPIO39: U6.19
GPIO40: U8.26
GPIO41: U7.26
GPIO42: U6.26
GPIO43: U5.26
GPIO44: U6.25
GPIO45: U5.25
GPIO46: U6.24
GPIO47: U5.24
GPIO48: SW1.3 SW4.3 SW7.3 U8.7
GPIO49: SW2.3 SW5.3 SW8.3 U7.7
GPIO50: SW3.3 SW6.3 SW9.3 U8.8
GPIO51: U7.8
GPIO52: U8.9
GPIO53: U7.9
GPIO54: U8.10
GPIO55: U7.10
GPIO56: U8.11
GPIO57: U7.11
GPIO58: U8.12
GPIO59: U7.12
GPIO60: U8.13
GPIO61: U7.13
GPIO62: U8.14
GPIO63: U7.14
GPIO64: R58.2 U8.15
GPIO65: R57.2 U7.15
GPIO66: R56.2 U8.16
GPIO67: R55.2 U7.16
GPIO68: R54.2 U8.17
GPIO69: U7.17
GPIO70: U8.18
GPIO71: U7.18
GPIO72: U8.19
GPIO73: U7.19
GPIO74: U8.20
GPIO75: U7.20
GPIO76: U8.21
GPIO77: U7.21
GPIO78: U8.22
GPIO79: U7.22
GPIO80: U6.23
GPIO81: U5.23
GPIO82: U6.22
GPIO83: U5.22
GPIO84: U6.21
GPIO85: U5.21
GPIO86: U6.20
GPIO87: U5.20
VAA200: C78.2 U2.2(VIN) U45.1
VAA400: C87.2 U22.2(VIN) U44.1
$1N5408: LED6.1(+) R54.1
$1N5529: LED7.1(+) R55.1
$1N5639: LED8.1(+) R56.1
$1N5749: LED9.1(+) R57.1
$1N5859: LED10.1(+) R58.1
$1N6144: R59.1 R61.1 SW1.2 SW2.2 SW3.2
$1N6401: R62.1 R63.1 SW4.2 SW5.2 SW6.2
$1N12242: R64.1 R65.1 SW7.2 SW8.2 SW9.2
$1N13106: C68.1 U18.1(BOOT)
$1N13107: C68.2 D3.1(K) L3.1 U18.8(PH)
$1N13113: R66.2 R67.1 U18.4(VSENSE)
$1N15426: C94.2 R2.1 R81.1 U1.4(-IN)
$1N15428: C79.2 R2.2 U2.6(VOUTN)
$1N15429: C79.1 R3.2 U2.7(VOUTP)
$1N15433: C80.2 R3.1 R4.2 U1.3(+IN)
$1N15437: C94.1 R5.2 R81.2 U1.1(OUT)
$1N15439: FB2.2 U1.5(V+)
$1N15450: C95.2 R68.1 R80.1 U21.4(-IN)
$1N15452: C88.2 R68.2 U22.6(VOUTN)
$1N15453: C88.1 R69.2 U22.7(VOUTP)
$1N15457: C89.2 R69.1 R70.2 U21.3(+IN)
$1N15461: C95.1 R72.2 R80.2 U21.1(OUT)
$1N15463: FB3.2 U21.5(V+)
$1N23607: LED11.1(+) R82.1
$1N23729: DC1.1 SW12.2

Not connected (* = marked no-connect by the designer): SCREW1 1; SCREW2 1; SCREW3 1; SCREW4 1; SW1 1 4; SW2 1 4; SW3 1 4; SW4 1 4; SW5 1 4; SW6 1 4; SW7 1 4; SW8 1 4; SW9 1 4; SW12 3 4 5 6; U9 2; U10 2; U18 2(NC)* 3(NC)* 5(ENA)*

## Notes on the sheet
- EPWM1A
- EPWM3A
- EPWM5A
- EPWM1B
- EPWM3B
- EPWM5B
- EPWM2B
- EPWM4B
- EPWM6B
- EPWM2A
- EPWM4A
- EPWM6A
- A0
- A1
- B0
- 最小系统板插入
- LED
- B1
- B1
- B0
- A1
- 辅电
- A0
- 端子
- 按键
- 采样

# Board PCB8
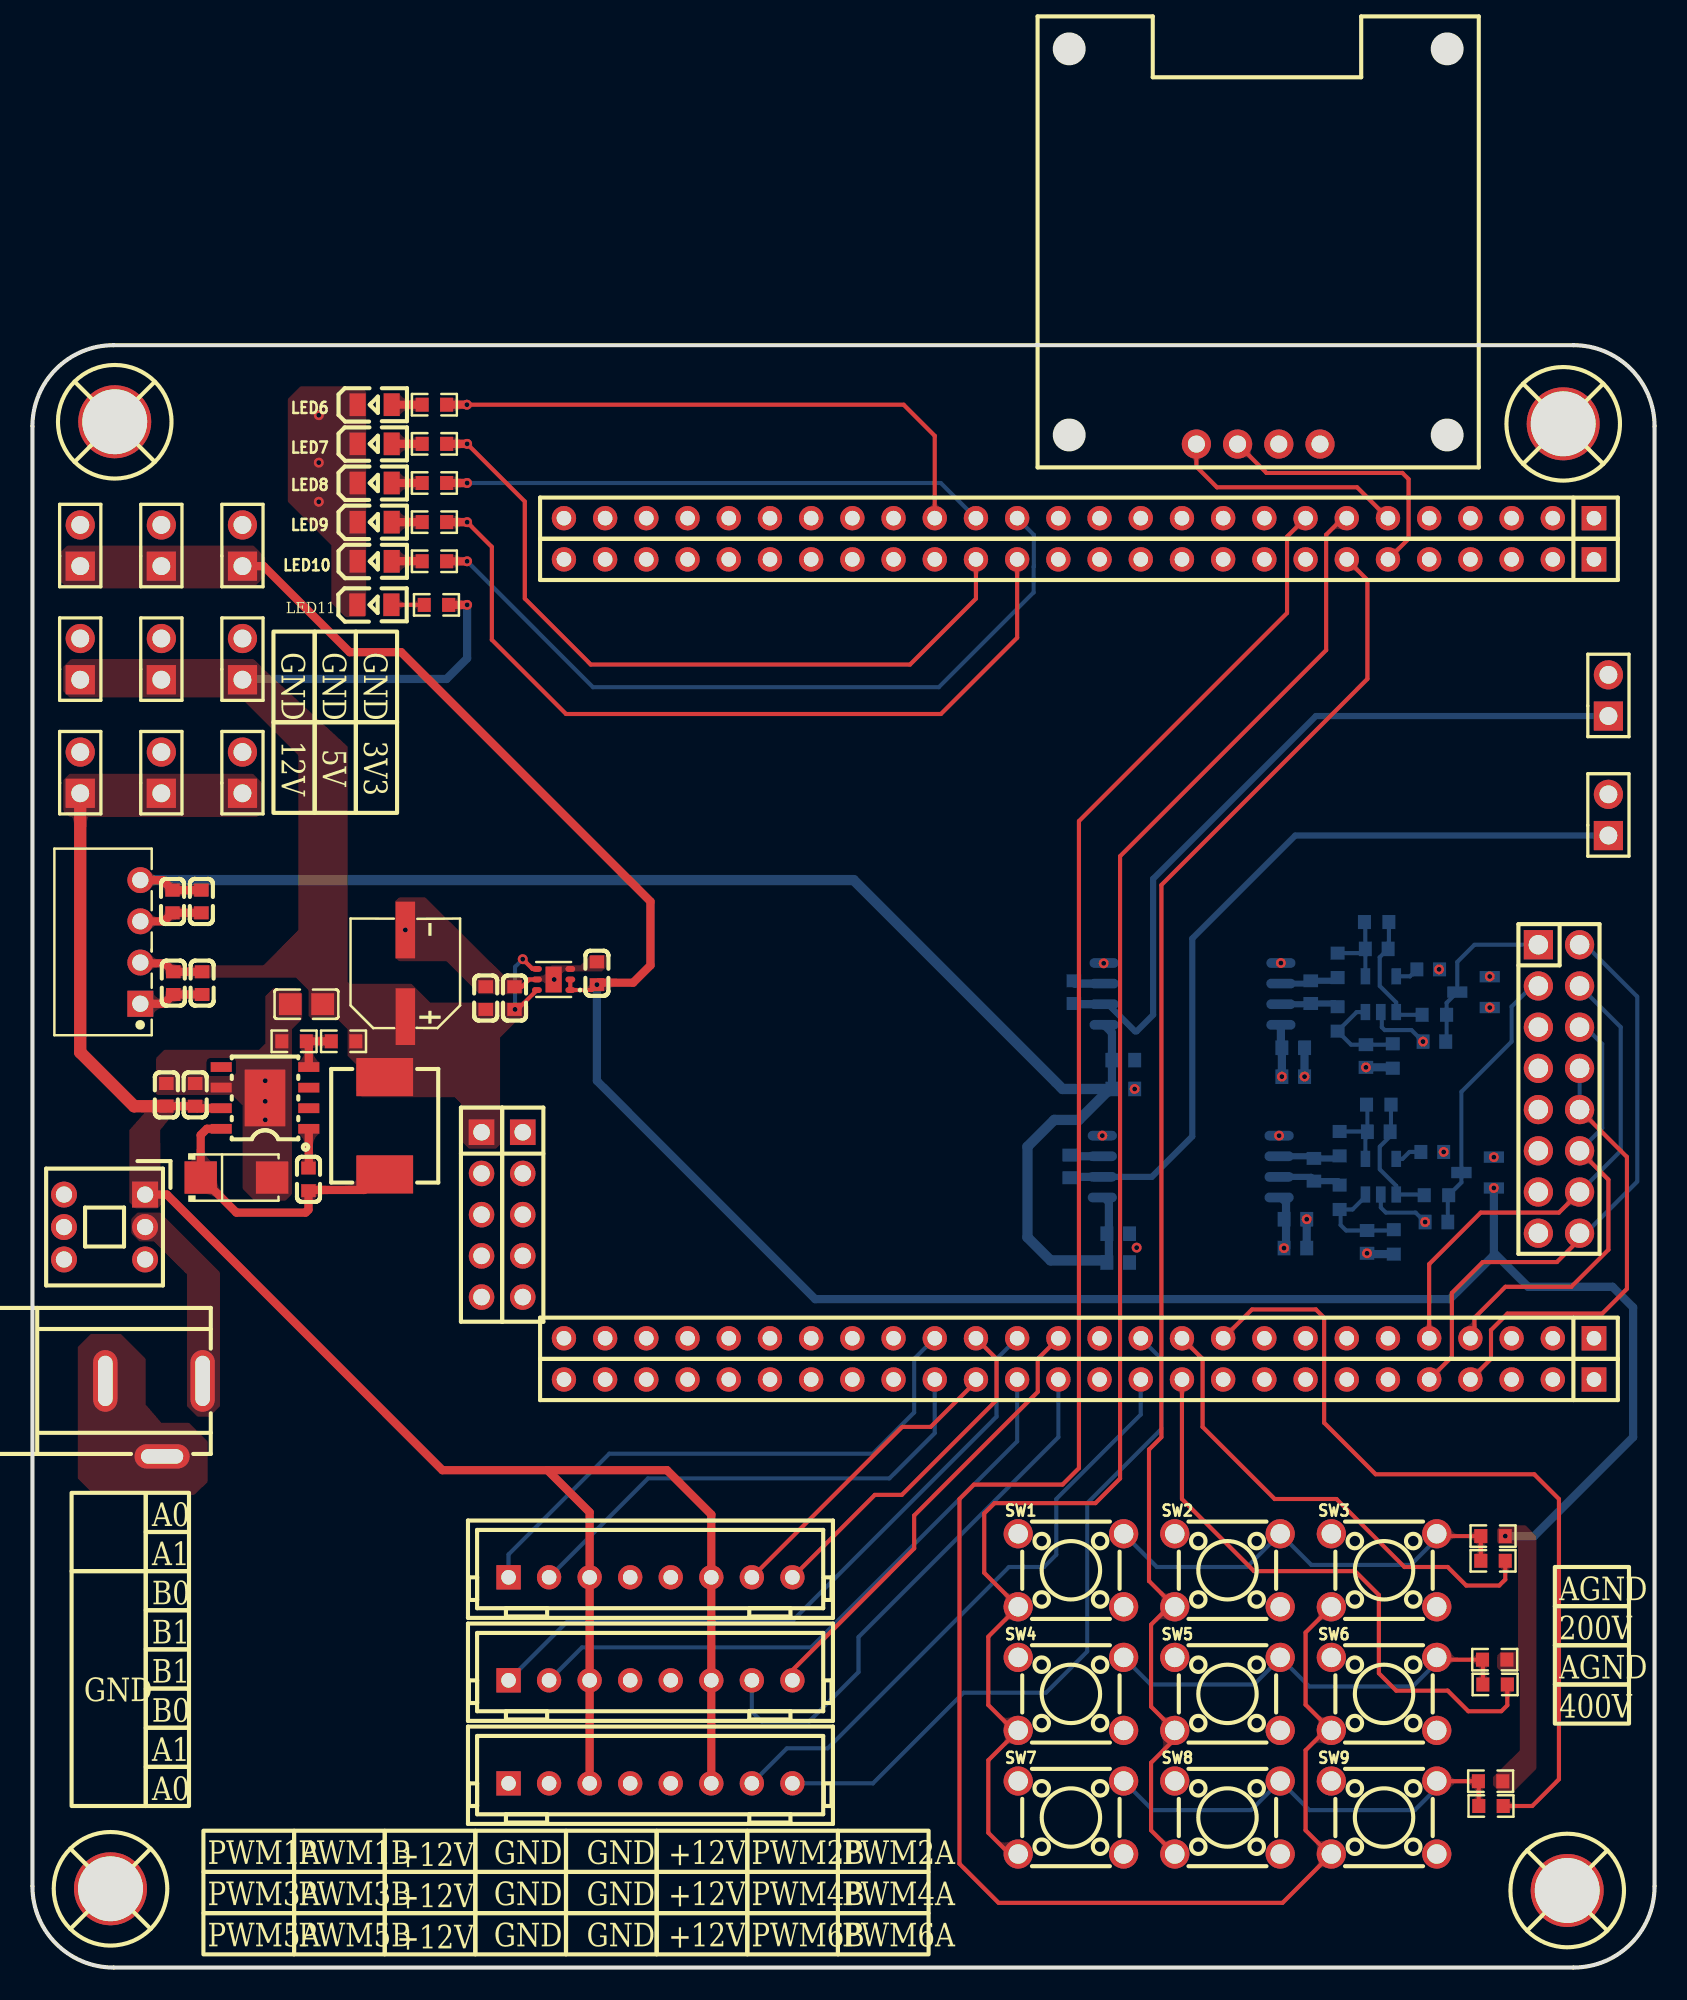
[diagram p1: board, top side]
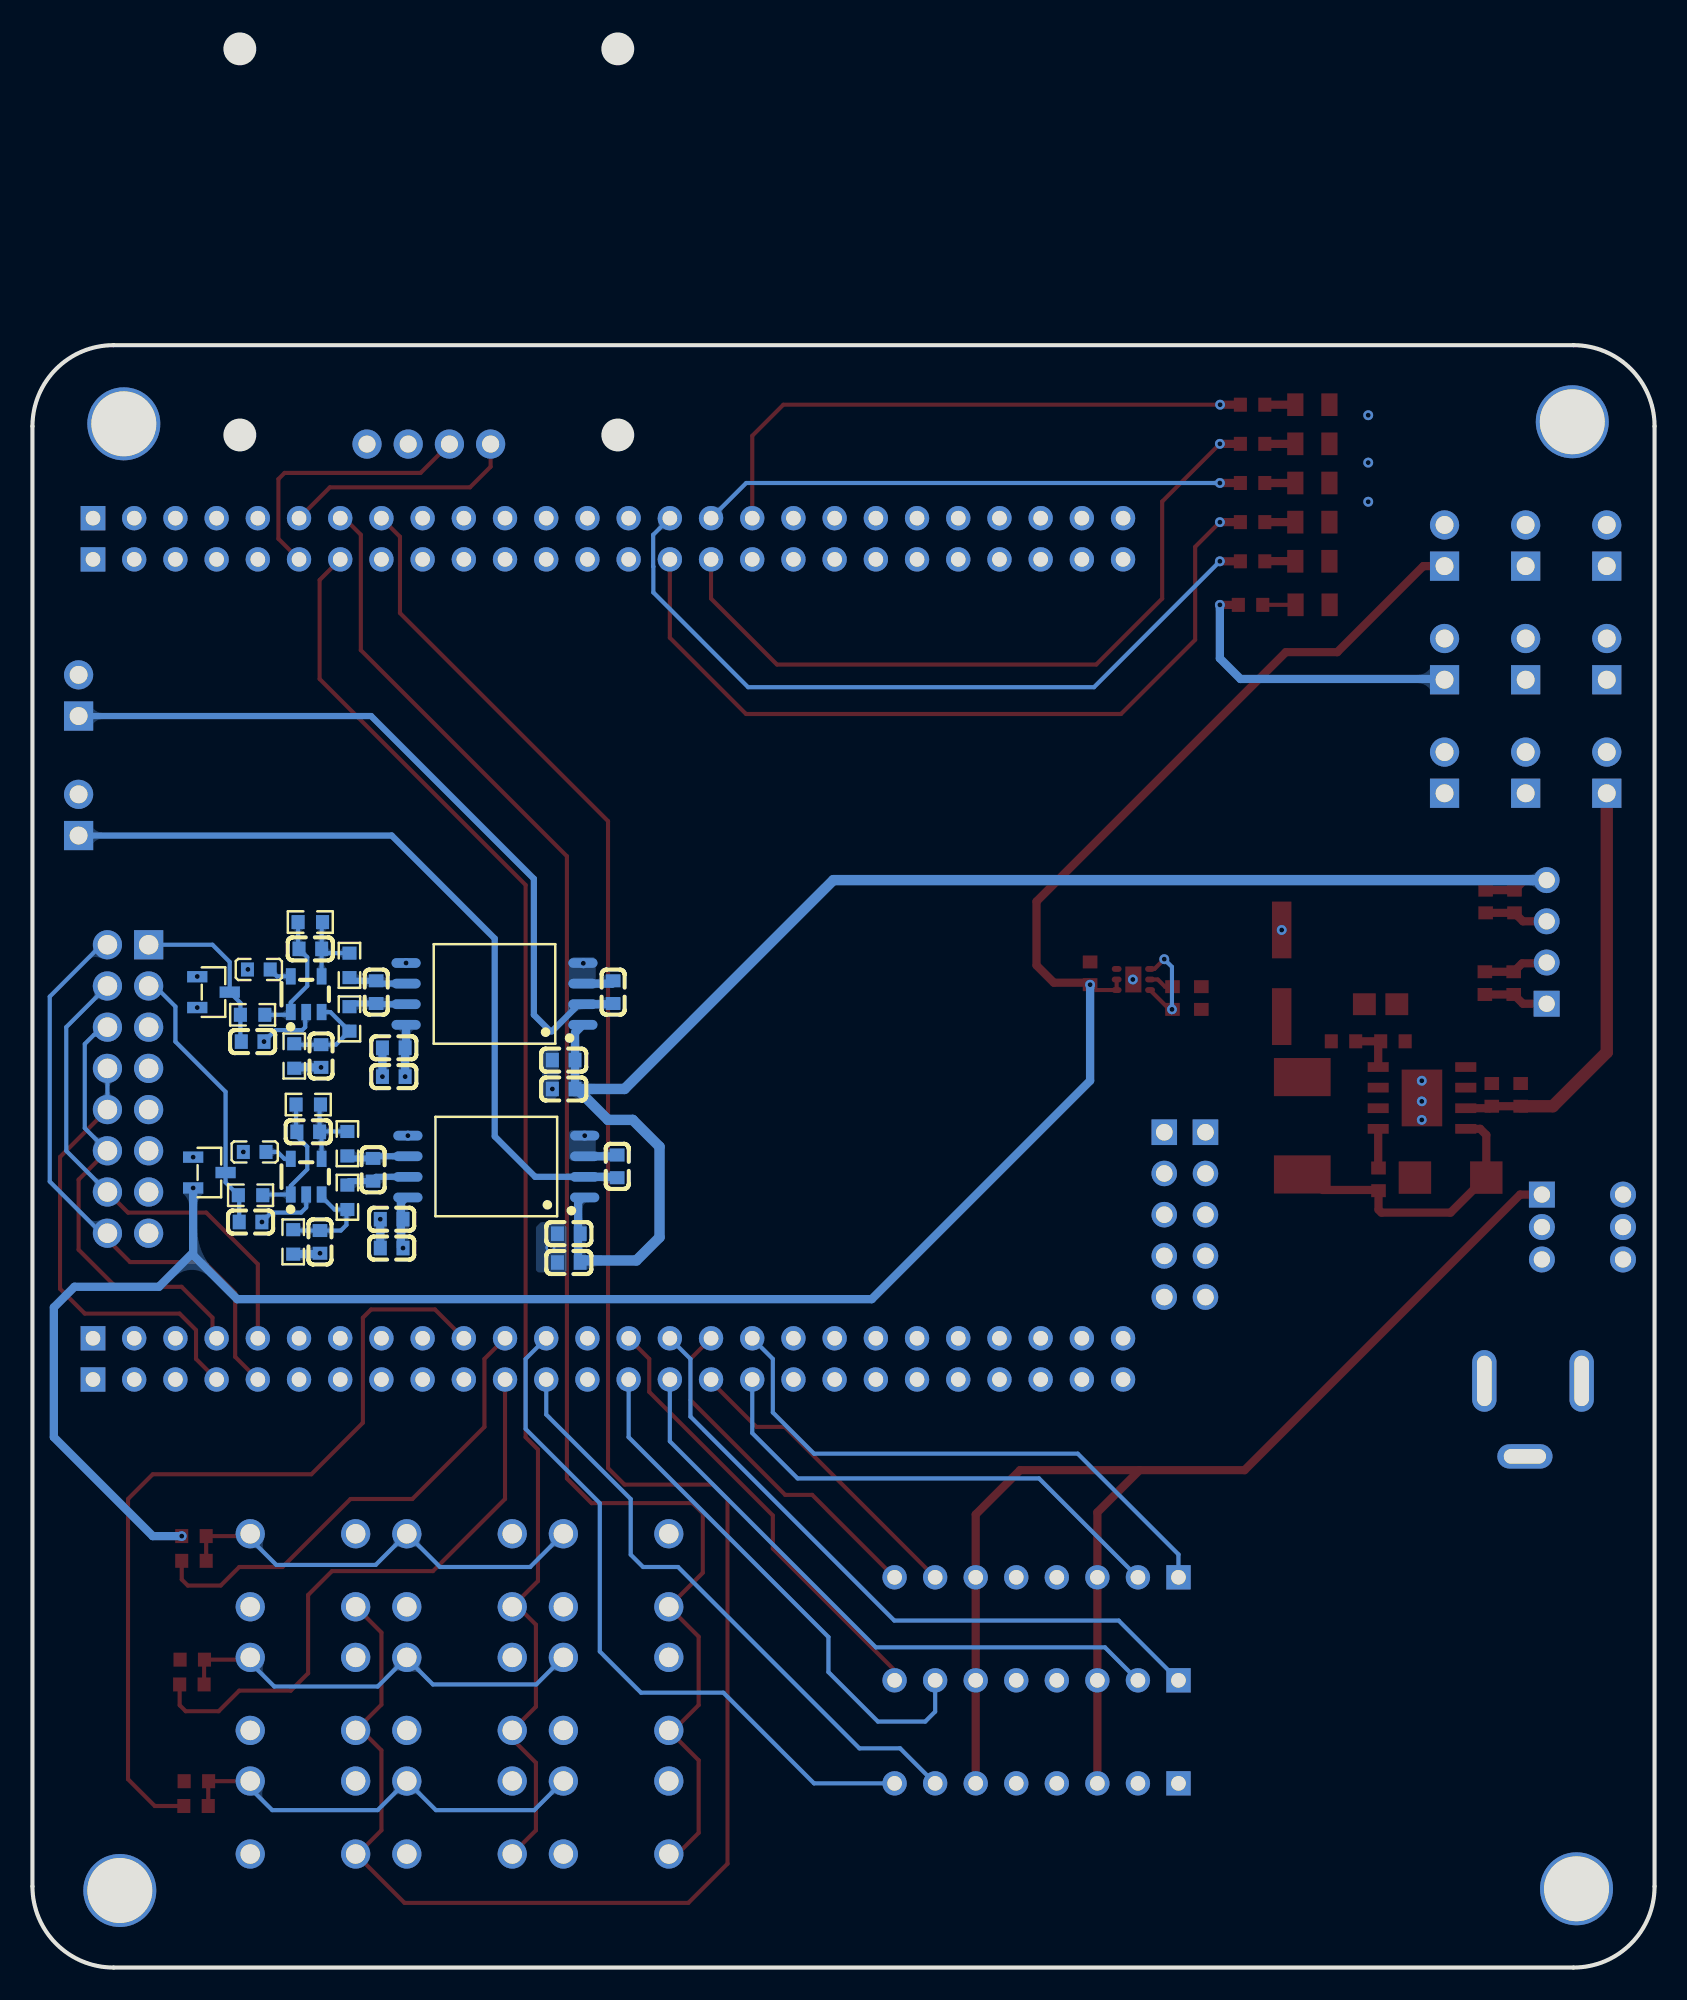
[diagram p2: board, bottom side, seen from below]

Outline 100 x 119.28 mm; copper layers: Top Layer, Inner1, Inner2, Bottom Layer. Coordinates in mm from the lower left corner of the outline.
Outline path: 0,95 0,5 arc(1.46,1.46) 5,0 95,0 arc(98.54,1.46) 100,5 100,95 arc(98.54,98.54) 95,100 5,100 arc(1.46,98.54) 0,95
Stack: Top Layer 0.035mm 外层铜厚1oz / Dielectric1 0.2104mm 7628 RC49% 8.6mil / Inner1 0.0152mm 内层铜厚 / Dielectric2 1.065mm 1.1mm H/HOZ Copper / Inner2 0.0152mm 内层铜厚 / Dielectric3 0.2104mm 7628 RC49% 8.6mil / Bottom Layer 0.035mm 外层铜厚1oz

## Design rules (mm)
template: 自定义配置
spacing copperThickness1oz (default): track to track 0.102, other pairs 0.152 to 0.3
spacing copperThickness2oz: track to track 0.203, other pairs 0.152 to 0.3
track width copperThickness1oz (default): min 0.127, default 0.254, max 2.54
track width copperThickness2oz: min 0.203, default 0.254, max 2.54
differential pair differentialPair (default): width min 0.127, default 0.254, max 2.54; gap min 0.152, default 0.152
via viaSize (default): diameter min 0.5, default 0.61, max 10; hole min 0.3, default 0.305, max 6.3

## Placement (name value [footprint] x y rotation side)
C62  2.2uF  [C0603]  34.8 61.28 270 top
C66  10uF  [C0603]  8.25 53.79 270 top
C67  100nF  [C0603]  10.03 53.79 270 top
C68  10nF  [C0603]  17.02 48.58 270 top
C69  220uF  [CAP-SMD_BD6.3-L6.6-W6.6-FD]  22.99 61.28 90 top
C70  10uF  [C0603]  27.94 59.76 270 top
C71  100nF  [C0603]  29.72 59.76 270 top
C72  2.2uF  [C0603]  10.46 60.68 90 top
C73  2.2uF  [C0603]  10.41 65.71 270 top
C74  10nF  [C0603]  8.68 60.68 90 top
C75  10nF  [C0603]  8.64 65.71 90 top
C76  10uF  [C0603]  67.25 54.15 180 bottom
C77  100nF  [C0603]  67.25 55.93 180 bottom
C78  100pF  [C0603]  64.2 60.12 270 bottom
C79  1nF  [C0603]  78.81 60.12 90 bottom
C80  1nF  [C0603]  82.21 56.19 90 bottom
C81  100nF  [C0603]  86.43 57.07 0 bottom
C82  100nF  [C0603]  77.72 56.69 180 bottom
C83  1uF  [C0603]  77.72 54.92 180 bottom
C85  10uF  [C0603]  66.93 43.46 180 bottom
C86  100nF  [C0603]  66.93 45.24 180 bottom
C87  100pF  [C0603]  63.95 49.38 270 bottom
C88  1nF  [C0603]  79 49.17 90 bottom
C89  1nF  [C0603]  82.27 44.73 90 bottom
C90  100nF  [C0603]  86.55 45.95 0 bottom
C91  100nF  [C0603]  77.86 46.12 180 bottom
C92  1uF  [C0603]  77.86 44.35 180 bottom
C93  22uF  [C0805]  16.89 59.38 0 top
C94  1nF  [C0603]  82.87 62.79 180 bottom
C95  1nF  [C0603]  83 51.52 180 bottom
CN1  WAFER-XH254Z-8AL  [CONN-TH_WAFER-XH254Z-8A]  38.1 24.05 0 top
CN2  WAFER-XH254Z-8AL  [CONN-TH_WAFER-XH254Z-8A]  38.1 17.7 0 top
CN3  WAFER-XH254Z-8AL  [CONN-TH_WAFER-XH254Z-8A]  38.1 11.35 0 top
D1  BAT54S  [SOT-23-3_L2.9-W1.3-P1.90-LS2.4-BR]  88.84 60.12 0 bottom
D3  B340A  [SMA_L4.3-W2.6-LS5.1-RD]  12.57 48.69 0 top
D4  BAT54S  [SOT-23-3_L2.9-W1.3-P1.90-LS2.4-BR]  89.09 49 0 bottom
DC1  DC-005-A200  [DC-IN-TH_DC-005-A200]  7.49 33.83 0 top
FB2  CBM160808U000T  [L0603]  86.04 61.52 180 bottom
FB3  CBM160808U000T  [L0603]  86.3 50.27 180 bottom
H1  PZ254V-12-16P  [HDR-TH_16P-P2.54-V-M-R2-C8-S2.54]  94.11 54.15 270 top
L3  15uH  [IND-SMD_L7.3-W6.8]  21.72 51.89 90 top
LED6  NCD0805R1  [LED0805-R-RD]  21.1 96.33 0 top
LED7  NCD0805R1  [LED0805-R-RD]  21.1 93.92 0 top
LED8  NCD0805R1  [LED0805-R-RD]  21.1 91.5 0 top
LED9  NCD0805R1  [LED0805-R-RD]  21.1 89.09 0 top
LED10  NCD0805R1  [LED0805-R-RD]  21.1 86.68 0 top
LED11  NCD0805R1  [LED0805-R-RD]  21.08 84 0 top
R2  10kΩ  [R0603]  80.46 61.77 270 bottom
R3  10kΩ  [R0603]  80.46 58.47 90 bottom
R4  10kΩ  [R0603]  83.86 56.19 90 bottom
R5  10kΩ  [R0603]  86.43 58.72 180 bottom
R54  1kΩ  [R0603]  24.78 96.33 0 top
R55  1kΩ  [R0603]  24.78 93.92 0 top
R56  1kΩ  [R0603]  24.78 91.5 0 top
R57  1kΩ  [R0603]  24.78 89.09 0 top
R58  1kΩ  [R0603]  24.78 86.68 0 top
R59  1kΩ  [R0603]  90.04 25.07 0 top
R61  10kΩ  [R0603]  90.04 26.59 0 top
R62  10kΩ  [R0603]  90.15 18.98 0 top
R63  1kΩ  [R0603]  90.17 17.45 0 top
R64  10kΩ  [R0603]  89.89 11.49 0 top
R65  1kΩ  [R0603]  89.92 9.96 0 top
R66  3.24kΩ  [R0603]  16.13 57.09 0 top
R67  10kΩ  [R0603]  19.18 57.09 0 top
R68  10kΩ  [R0603]  80.58 50.78 270 bottom
R69  10kΩ  [R0603]  80.58 47.48 90 bottom
R70  10kΩ  [R0603]  83.93 44.73 90 bottom
R72  10kΩ  [R0603]  86.55 47.6 180 bottom
R80  20kΩ  [R0603]  83 53.19 0 bottom
R81  20kΩ  [R0603]  82.87 64.44 0 bottom
R82  1kΩ  [R0603]  24.91 83.99 0 top
SCREW1  -  [M4螺丝]  4.81 4.85 0 top
SCREW2  -  [M4螺丝]  5.07 95.28 0 top
SCREW3  -  [M4螺丝]  94.62 4.75 0 top
SCREW4  -  [M4螺丝]  94.37 95.15 0 top
SW1  TS-1095-A10B3-D1  [SW-TH_4P-L6.0-W6.0-P4.50-LS6.5]  64.02 24.49 0 top
SW2  TS-1095-A10B3-D1  [SW-TH_4P-L6.0-W6.0-P4.50-LS6.5]  73.67 24.49 0 top
SW3  TS-1095-A10B3-D1  [SW-TH_4P-L6.0-W6.0-P4.50-LS6.5]  83.32 24.49 0 top
SW4  TS-1095-A10B3-D1  [SW-TH_4P-L6.0-W6.0-P4.50-LS6.5]  64.02 16.87 0 top
SW5  TS-1095-A10B3-D1  [SW-TH_4P-L6.0-W6.0-P4.50-LS6.5]  73.67 16.87 0 top
SW6  TS-1095-A10B3-D1  [SW-TH_4P-L6.0-W6.0-P4.50-LS6.5]  83.32 16.87 0 top
SW7  TS-1095-A10B3-D1  [SW-TH_4P-L6.0-W6.0-P4.50-LS6.5]  64.02 9.25 0 top
SW8  TS-1095-A10B3-D1  [SW-TH_4P-L6.0-W6.0-P4.50-LS6.5]  73.67 9.25 0 top
SW9  TS-1095-A10B3-D1  [SW-TH_4P-L6.0-W6.0-P4.50-LS6.5]  83.32 9.25 0 top
SW12  XKB7070-Z  [SW-TH_6P-L7.0-W7.0-P2.00]  4.44 45.64 0 top
U1  OPA320AQDBVRQ1  [SOT-23-5_L2.9-W1.6-P0.95-LS2.8-BR]  83.12 60 270 bottom
U2  AMC1311BDWVR  [SOIC-8_L7.5-W5.9-P1.27-LS11.5-BL]  71.51 60.01 90 bottom
U5  X6511FV-26-C85D32  [HDR-TH_26P-P2.54-V-F]  64.52 36.25 180 top
U6  X6511FV-26-C85D32  [HDR-TH_26P-P2.54-V-F]  64.52 38.79 180 top
U7  X6511FV-26-C85D32  [HDR-TH_26P-P2.54-V-F]  64.52 86.8 180 top
U8  X6511FV-26-C85D32  [HDR-TH_26P-P2.54-V-F]  64.52 89.34 180 top
U9  PM2.54-1*5  [HDR-TH_5P-P2.54-V-F]  30.23 46.41 270 top
U10  PM2.54-1*5  [HDR-TH_5P-P2.54-V-F]  27.69 46.41 270 top
U18  TPS5430DDAR  [ESOP-8_L4.9-W3.9-P1.27-LS6.0-TL-EP]  14.34 53.6 180 top
U19  TLV76733DRVR  [WSON-6_L2.0-W2.0-P0.65-TL-EP]  32.13 60.9 180 top
U20  B0505S-1WR3  [PWRM-TH_B0505S-1WR3]  6.65 63.22 90 top
U21  OPA320AQDBVRQ1  [SOT-23-5_L2.9-W1.6-P0.95-LS2.8-BR]  83.12 48.75 270 bottom
U22  AMC1311BDWVR  [SOIC-8_L7.5-W5.9-P1.27-LS11.5-BL]  71.41 49.37 90 bottom
U30  HS96L03W2C03  [OLED-TH_L27.8-W27.2-P2.54_C9900033791]  75.56 93.9 180 top
U35  HX PZ2.54-1x2P ZZ  [HDR-TH_2P-P2.54-V-M-3]  2.95 73.65 90 top
U36  HX PZ2.54-1x2P ZZ  [HDR-TH_2P-P2.54-V-M-3]  2.95 80.65 90 top
U37  HX PZ2.54-1x2P ZZ  [HDR-TH_2P-P2.54-V-M-3]  2.95 87.65 90 top
U38  HX PZ2.54-1x2P ZZ  [HDR-TH_2P-P2.54-V-M-3]  7.95 73.65 90 top
U39  HX PZ2.54-1x2P ZZ  [HDR-TH_2P-P2.54-V-M-3]  7.95 80.65 90 top
U40  HX PZ2.54-1x2P ZZ  [HDR-TH_2P-P2.54-V-M-3]  7.95 87.65 90 top
U41  HX PZ2.54-1x2P ZZ  [HDR-TH_2P-P2.54-V-M-3]  12.95 73.65 90 top
U42  HX PZ2.54-1x2P ZZ  [HDR-TH_2P-P2.54-V-M-3]  12.95 80.65 90 top
U43  HX PZ2.54-1x2P ZZ  [HDR-TH_2P-P2.54-V-M-3]  12.95 87.65 90 top
U44  HX PZ2.54-1x2P ZZ  [HDR-TH_2P-P2.54-V-M-3]  97.16 71.04 90 top
U45  HX PZ2.54-1x2P ZZ  [HDR-TH_2P-P2.54-V-M-3]  97.16 78.41 90 top

## Footprints (pads in the part's own frame, mm; a bottom-side part is the same pattern mirrored in y, then rotated)
C0603
  rect 0.8x0.9 smd: 1(-0.7,0) 2(0.7,0)
C0805
  rect 1.41x1.35 smd: 1(-1,0) 2(1,0)
CAP-SMD_BD6.3-L6.6-W6.6-FD
  rect 3.5x1.2 smd: 1(-2.67,0) 2(2.67,0)
CONN-TH_WAFER-XH254Z-8A
  rect 1.5x1.5 hole 0.9: 1(-8.75,0)
  round 1.5 hole 0.9: 2(-6.25,0) 3(-3.75,0) 4(-1.25,0) 5(1.25,0) 6(3.75,0) 7(6.25,0) 8(8.75,0)
DC-IN-TH_DC-005-A200
  oval 1.5x3.8 hole 0.9x3.1: 1(3,2.325) 2(-3,2.325)
  oval 3.4x1.5 hole 2.6x0.9: 3(0.5,-2.325)
ESOP-8_L4.9-W3.9-P1.27-LS6.0-TL-EP
  rect 1.3x0.6 smd: 1(-2.7,1.905) 2(-2.7,0.635) 3(-2.7,-0.635) 4(-2.7,-1.905) 5(2.7,-1.905) 6(2.7,-0.635) 7(2.7,0.635) 8(2.7,1.905)
  rect 2.5x3.5 smd: 9(0,0)
HDR-TH_2P-P2.54-V-M-3
  rect 1.8x1.8 hole 1.1: 1(-1.27,0)
  round 1.8 hole 1.1: 2(1.27,0)
HDR-TH_5P-P2.54-V-F
  rect 1.575x1.575 hole 1.02: 1(-5.08,0)
  round 1.575 hole 1.02: 2(-2.54,0) 3(0,0) 4(2.54,0) 5(5.08,0)
HDR-TH_16P-P2.54-V-M-R2-C8-S2.54
  rect 1.8x1.8 hole 1.2: 1(-8.89,-1.27)
  round 1.8 hole 1.2: 2(-8.89,1.27) 3(-6.35,-1.27) 4(-6.35,1.27) 5(-3.81,-1.27) 6(-3.81,1.27) 7(-1.27,-1.27) 8(-1.27,1.27) 9(1.27,-1.27) 10(1.27,1.27) 11(3.81,-1.27) 12(3.81,1.27) 13(6.35,-1.27) 14(6.35,1.27) 15(8.89,-1.27) 16(8.89,1.27)
HDR-TH_26P-P2.54-V-F
  rect 1.524x1.5 hole 0.9: 1(-31.75,0)
  round 1.5 hole 0.9: 2(-29.21,0) 3(-26.67,0) 4(-24.13,0) 5(-21.59,0) 6(-19.05,0) 7(-16.51,0) 8(-13.97,0) 9(-11.43,0) 10(-8.89,0) 11(-6.35,0) 12(-3.81,0) 13(-1.27,0) 14(1.27,0) 15(3.81,0) 16(6.35,0) 17(8.89,0) 18(11.43,0) 19(13.97,0) 20(16.51,0) 21(19.05,0) 22(21.59,0) 23(24.13,0) 24(26.67,0) 25(29.21,0) 26(31.75,0)
IND-SMD_L7.3-W6.8
  rect 2.35x3.5 smd: 1(-3,0) 2(3,0)
L0603
  rect 0.8x0.864 smd: 1(-0.7,0) 2(0.7,0)
LED0805-R-RD
  rect 1x1.399 smd: 1(1.05,0) 2(-1.05,0)
M4螺丝
  round 4.5 hole 4: 1(0,0)
OLED-TH_L27.8-W27.2-P2.54_C9900033791
  round 1.8 hole 1.05: 1(-3.81,0) 2(-1.27,0) 3(1.27,0) 4(3.81,0)
PWRM-TH_B0505S-1WR3
  rect 1.6x1.6 hole 1: 1(-3.81,0)
  round 1.6 hole 1: 2(-1.27,0) 3(1.27,0) 4(3.81,0)
R0603
  rect 0.806x0.864 smd: 1(-0.753,0) 2(0.753,0)
SMA_L4.3-W2.6-LS5.1-RD
  rect 2x2 smd: 1(-2.2,0) 2(2.2,0)
SOIC-8_L7.5-W5.9-P1.27-LS11.5-BL
  oval 0.6x1.8 smd: 1(-1.905,-5.45) 2(-0.635,-5.45) 3(0.635,-5.45) 4(1.905,-5.45) 5(1.905,5.45) 6(0.635,5.45) 7(-0.635,5.45) 8(-1.905,5.45)
SOT-23-3_L2.9-W1.3-P1.90-LS2.4-BR
  rect 1.25x0.7 smd: 1(1,-0.95) 2(1,0.95) 3(-1,0)
SOT-23-5_L2.9-W1.6-P0.95-LS2.8-BR
  rect 1x0.6 smd: 1(1.1,-0.95) 2(1.1,0) 3(1.1,0.95) 4(-1.1,0.95) 5(-1.1,-0.95)
SW-TH_4P-L6.0-W6.0-P4.50-LS6.5
  round 1.8 hole 1.2: 1(-3.25,2.25) 2(3.25,2.25) 3(-3.25,-2.25) 4(3.25,-2.25)
SW-TH_6P-L7.0-W7.0-P2.00
  rect 1.6x1.6 hole 1: 1(2.499,2)
  round 1.6 hole 1: 2(2.5,0) 3(2.5,-2) 4(-2.5,2) 5(-2.5,0) 6(-2.5,-2)
WSON-6_L2.0-W2.0-P0.65-TL-EP
  oval 0.607x0.364 smd: 1(-1.028,0.65) 2(-1.028,0) 3(-1.028,-0.65) 4(1.028,-0.65) 5(1.028,0) 6(1.028,0.65)
  rect 1x1.6 smd: 7(0,0)

## Nets
As in the schematic.

Pads without a net: SCREW1 1; SCREW2 1; SCREW3 1; SCREW4 1; SW1 1 4; SW2 1 4; SW3 1 4; SW4 1 4; SW5 1 4; SW6 1 4; SW7 1 4; SW8 1 4; SW9 1 4; SW12 3 4 5 6; U9 2; U10 2; U18 2 3 5

## Via types
v1: diameter 0.61, hole 0.305, Top Layer to Bottom Layer, 38 vias

## Routing (per net, layer and track width the routed paths; a pad name or vN(x,y) marks a point on that pad's centre or on a via; arc(x,y) is an arc through that point)
5V1: length 122.3
  Top Layer w0.254: v1(30.23,62.15) 30.83,61.55 U19.4 ; U19.6 29.91,59.06 C71.2
  Top Layer w0.508: U20.2 6.7,61.9 8.16,61.9 8.68,61.38 10.46,61.38 ; R82.2 v1(26.8,83.99)
  Inner1 w0.254: 76.84,54.92 v1(77.02,54.92)
  Inner1 w0.508: v1(87,50.27) 84.39,52.88 79.12,52.88 77.09,54.92 v1(77.02,54.92) 77.02,56.63 81.92,61.52 v1(86.72,61.52) ; v1(29.75,59.06) 33.9,54.92 76.84,54.92 74.8,52.88 74.8,46.7 v1(77.16,44.35)
  Bottom Layer w0.254: v1(29.75,59.06) 29.75,61.68 v1(30.23,62.15)
  Bottom Layer w0.508: v1(77.02,54.92) C82.2 76.97,56.75 76.97,58.11 ; 76.98,47.47 77.28,47.17 77.28,44.35 ; v1(26.8,83.99) 26.8,80.7 25.53,79.43 12.99,79.43 U42.1
+3V3: length 218.9
  Top Layer w0.254: v1(34.8,60.58) 34.47,60.25 U19.1 U19.2
  Top Layer w0.508: U43.1 14.26,86.38 19.56,81.08 22.73,81.08 38.1,65.71 38.1,61.77 37.03,60.7 34.92,60.7 v1(34.8,60.58)
  Inner1 w0.508: v1(90.09,48.05) 88.52,49.63 88.52,57.85 v1(89.84,59.17) 88.52,60.49 88.52,80.31 92.33,84.12 97.54,84.12 98.68,85.27 98.68,90.6 97.66,91.62 79.12,91.62 U30.2
  Bottom Layer w0.508: 90.17,43.99 92.2,41.96 97.41,41.96 98.68,40.69 98.68,32.69 92.58,26.59 v1(90.8,26.59) ; 34.8,60.5 34.8,54.66 48.26,41.2 87.38,41.2 90.09,43.92 v1(90.09,48.05)
+5VA: length 95.2
  Top Layer w0.508: U20.4 8.02,67.03 C75.2 C73.1
  Bottom Layer w0.508: 66.08,47.47 66.36,47.19 66.36,43.46 ; C76.2 C77.2 66.55,57.62 U2.1
  Bottom Layer w0.635: 66.42,54.15 C76.2 ; 66.42,54.15 64.52,52.25 62.99,52.25 61.34,50.6 61.34,45.01 62.76,43.58 66.11,43.58 C85.2 ; 66.42,54.15 63.5,54.15 50.63,67.03 U20.4
+12V: length 106.1
  Top Layer w0.508: SW12.1 8.29,47.64 25.27,30.66 31.75,30.66 ; 31.75,30.66 39.12,30.66 41.85,27.92 CN1.6 CN2.6 CN3.6 ; 31.75,30.66 34.35,28.06 CN1.3 CN2.3 CN3.3 ; C66.2 C67.2 10.16,52.97 U18.7
  Top Layer w0.762: C66.2 6.27,53.09 2.95,56.41 U35.1
AGND: length 8
  Top Layer w0.508: U20.3 8.11,64.49 C75.1 C73.2
  Bottom Layer w0.508: U2.3 64.26,60.65 64.2,60.71 C78.1 ; 64.07,50.08 64.15,50.01 66.08,50.01
  vias: v1(65.96,51.28) v1(66.04,61.9) v1(67.95,54.15) v1(68.07,44.37)
AGND1: length 18.7
  Top Layer w0.508: U20.1 8.11,59.41 C74.1 C72.1
  Bottom Layer w0.254: U1.2 83.19,58.83 83.19,57.96 83.36,57.78 85.02,57.78 v1(85.73,57.07) ; v1(85.85,45.95) 85.27,46.53 83.44,46.53 83.12,46.85 U21.2
  Bottom Layer w0.508: C82.1 v1(78.42,54.92) ; v1(82.21,55.48) 83.81,55.48 R4.1 ; v1(78.56,46.12) C92.1 ; v1(82.27,44.03) 82.33,43.97 83.93,43.97
  vias: v1(76.85,51.28) v1(76.97,61.92)
GND1: length 1.6
  Top Layer w0.254: C71.1 30.18,60.46 30.62,60.9 U19.5
  vias: v1(14.35,54.66) v1(14.35,53.39) v1(14.35,52.25) v1(17.65,95.68) v1(17.65,92.76) v1(17.65,90.35) v1(22.99,63.95) v1(32.16,60.9) v1(89.84,61.09) v1(90.09,49.95)
200ADC: length 10.6
  Bottom Layer w0.254: H1.1 88.9,63.04 87.84,61.98 D1.3 87.18,59.46 R5.1 87.18,57.13 C81.2
400ADC: length 17.1
  Bottom Layer w0.254: H1.3 92.46,60.5 91.19,59.23 91.19,57.07 88.09,53.98 D4.3 88.09,48.39 R72.1 87.25,47.55 C90.2
AD0IN0: length 36.7
  Top Layer w0.254: H1.16 95.38,44.88 93.98,43.48 89.41,43.48 87.5,41.58 87.5,37.64 U5.5
  Bottom Layer w0.254: H1.2 95.38,63.04 95.74,63.04 98.93,59.85 98.93,48.45 95.74,45.26 95.38,45.26 H1.16
AD0IN1: length 30.5
  Top Layer w0.254: U6.5 86.11,43.36 89.28,46.53 94.11,46.53 H1.14
  Bottom Layer w0.254: H1.14 97.92,50.34 97.92,57.96 H1.4
AD1IN0: length 27.2
  Top Layer w0.254: H1.12 97.16,48.56 97.16,44.25 94.87,41.96 90.81,41.96 88.9,40.06 88.9,39.04 U6.4
  Bottom Layer w0.254: H1.6 95.83,57.51 96.19,57.51 96.77,56.92 96.77,51.74 H1.12
AD1IN1: length 27.8
  Top Layer w0.254: H1.10 98.3,49.96 98.3,41.83 96.77,40.31 90.93,40.31 89.92,39.29 89.92,37.52 U5.4
  Bottom Layer w0.254: H1.10 H1.8
GPIO0: length 35.1
  Bottom Layer w0.254: U6.17 54.36,37.52 54.36,34.21 51.82,31.67 35.56,31.67 29.35,25.46 CN1.1
GPIO1: length 30.8
  Bottom Layer w0.254: U5.17 55.63,32.94 52.83,30.15 37.95,30.15 CN1.2
GPIO2: length 21.4
  Top Layer w0.254: U6.16 59.44,37.52 59.44,34.98 53.59,29.13 51.93,29.13 CN1.8
GPIO3: length 18.9
  Top Layer w0.254: CN1.7 53.62,33.33 55.37,33.33 58.17,36.12 U5.16
GPIO4: length 42.2
  Bottom Layer w0.254: U6.15 59.44,37.52 59.44,33.96 46.86,21.39 33.03,21.39 CN2.1
GPIO5: length 38.8
  Bottom Layer w0.254: U5.15 60.71,32.44 48.01,19.74 33.88,19.74 CN2.2
GPIO6: length 27.9
  Top Layer w0.254: CN2.8 46.85,18.33 54.36,25.83 54.36,27.86 61.98,35.48 61.98,37.52 U6.14
GPIO7: length 33.2
  Bottom Layer w0.254: U5.14 63.25,32.69 50.93,20.37 50.93,18.21 47.88,15.16 44.96,15.16 44.35,15.77 CN2.7
GPIO8: length 51.3
  Inner1 w0.254: CN3.1 32.65,14.66 47.62,14.66 57.28,24.31 57.28,27.23 64.52,34.47 64.52,37.52 U6.13
GPIO9: length 53.3
  Inner1 w0.254: U5.13 65.79,28.88 61.59,24.69 60.32,24.69 50.34,14.71 50.34,9.5 50.16,9.32 33.88,9.32 CN3.2
GPIO10: length 43.3
  Bottom Layer w0.254: CN3.8 51.82,11.35 57.4,16.94 62.48,16.94 65.02,19.48 65.02,28.63 69.6,33.2 69.6,37.52 U6.12
GPIO11: length 37.6
  Bottom Layer w0.254: CN3.7 46.51,13.51 49.02,13.51 60.2,24.69 62.36,24.69 63.12,25.45 63.12,28.88 68.33,34.09 U5.12
GPIO12: length 30
  Top Layer w0.254: U6.11 72.14,37.52 72.14,33.33 76.58,28.88 80.39,28.88 84.58,24.69 87.25,24.69 88.39,23.55 90.42,23.55 90.8,23.92 R59.2
GPIO13: length 37.1
  Top Layer w0.254: R63.2 90.92,16.17 90.55,15.8 88.52,15.8 87.25,17.07 84.07,17.07 83.01,18.14 83.01,22.96 81.53,24.44 75.31,24.44 70.87,28.88 U5.11
GPIO14: length 51.5
  Top Layer w0.254: U6.10 75.18,40.56 79.12,40.56 79.63,40.06 79.63,33.58 82.8,30.4 92.58,30.4 94.11,28.88 94.11,11.61 92.46,9.96 R65.2
GPIO32: length 14.5
  Top Layer w0.254: U30.4 71.75,92.51 73.03,91.24 81.66,91.24 U8.6
GPIO33: length 16.9
  Top Layer w0.254: U7.6 84.84,88.07 84.84,91.75 84.46,92.13 76.07,92.13 U30.3
GPIO48: length 99.8
  Top Layer w0.254: U8.7 80.78,89.34 79.76,88.32 79.76,81.2 67.05,68.5 67.05,30.14 65.53,28.63 59.31,28.63 58.67,27.99 58.67,24.33 SW1.3 58.93,20.4 58.93,16.18 60.49,14.62 SW4.3 58.93,12.78 58.93,8.31 60.24,7 SW7.3
GPIO49: length 89.2
  Top Layer w0.254: U7.7 82.3,85.53 82.3,79.43 69.6,66.73 69.6,32.69 68.83,31.93 68.83,23.83 SW2.3 70.07,22.24 68.96,21.13 68.96,16.08 SW5.3 70.42,14.08 68.96,12.62 68.96,8.46 SW8.3
GPIO50: length 138.3
  Top Layer w0.254: U8.8 77.34,88.19 77.34,83.49 64.52,70.66 64.52,30.78 63.5,29.77 58.04,29.77 57.15,28.88 57.15,6.4 59.56,3.99 77.06,3.99 SW9.3 79.95,7 78.49,8.46 78.49,13.39 79.71,14.62 SW6.3 78.49,16.21 78.49,20.65 SW3.3
GPIO64: length 46.8
  Top Layer w0.508: R58.2 v1(26.8,86.68)
  Bottom Layer w0.254: U8.15 61.74,88.31 61.74,86.37 61.72,86.36 61.72,84.76 55.88,78.92 34.56,78.92 v1(26.8,86.68)
GPIO65: length 50.2
  Top Layer w0.254: U7.15 60.71,81.97 56.01,77.27 32.89,77.27 28.32,81.84 28.32,87.57 v1(26.8,89.09)
  Top Layer w0.508: R57.2 v1(26.8,89.09)
GPIO66: length 33.5
  Top Layer w0.508: R56.2 v1(26.8,91.5)
  Bottom Layer w0.254: U8.16 56,91.5 v1(26.8,91.5)
GPIO67: length 45.9
  Top Layer w0.254: U7.16 58.17,84.38 54.1,80.31 34.42,80.31 30.35,84.38 30.35,90.36 v1(26.8,93.92)
  Top Layer w0.508: R55.2 v1(26.8,93.92)
GPIO68: length 36
  Top Layer w0.254: v1(26.78,96.33) 53.71,96.33 55.63,94.41 U8.17
  Top Layer w0.508: R54.2 v1(26.78,96.33)
VAA200: length 46.6
  Bottom Layer w0.381: U2.2 66.3,59.38 67.97,57.71 68.07,57.71 69.09,58.72 69.09,67.11 79.12,77.14 U45.1
  Bottom Layer w0.508: U2.2 64.25,59.38 C78.2
VAA400: length 49
  Bottom Layer w0.381: U44.1 77.85,69.77 71.5,63.42 71.5,51.23 69.01,48.74 U22.2
  Bottom Layer w0.508: U22.2 64.13,48.74 64.07,48.68
$1N5408: length 1.9
  Top Layer w0.508: LED6.1 R54.1
$1N5529: length 1.9
  Top Layer w0.508: LED7.1 R55.1
$1N5639: length 1.9
  Top Layer w0.508: LED8.1 R56.1
$1N5749: length 1.9
  Top Layer w0.508: LED9.1 R57.1
$1N5859: length 1.9
  Top Layer w0.254: 24.02,86.69 R58.1 ; LED10.1 22.16,86.69
  Top Layer w0.508: 22.16,86.69 24.02,86.69
$1N6144: length 27.1
  Top Layer w0.254: R59.1 R61.1 86.72,26.59 SW3.2
  Bottom Layer w0.254: SW1.2 69.32,24.69 74.87,24.69 SW2.2 78.84,24.82 84.96,24.82 86.57,26.43 SW3.2
$1N6401: length 26.8
  Top Layer w0.254: R63.1 89.42,18.96 R62.1 87.22,18.98 87.08,19.12 SW6.2
  Bottom Layer w0.254: SW6.2 86.57,18.81 85.09,17.32 78.72,17.32 SW5.2 76.92,19.06 75.31,17.45 68.94,17.45 SW4.2
$1N12242: length 26.6
  Top Layer w0.254: SW9.2 86.59,11.49 R64.1 89.16,11.46 R65.1
  Bottom Layer w0.254: SW9.2 86.57,11.06 85.22,9.7 78.72,9.7 SW8.2 75.13,9.7 69.06,9.7 SW7.2
$1N13106: length 2.4
  Top Layer w0.508: U18.1 17.04,49.3 C68.1
$1N13107: length 17.9
  Top Layer w0.508: L3.1 21.4,48.89 20.45,47.93 17.06,47.93 C68.2 17.02,46.71 16.84,46.53 12.57,46.53 10.41,48.69 10.37,48.69 10.37,51.32 10.75,51.7 U18.8
$1N13113: length 3.2
  Top Layer w0.508: U18.4 17.04,56.94 R66.2 R67.1
$1N15426: length 5.2
  Bottom Layer w0.254: U1.4 82.17,62.78 C94.2 ; R2.1 81.91,62.53 C94.2 ; R81.1 82.17,64.39 C94.2
$1N15428: length 3.6
  Bottom Layer w0.381: 76.97,60.65 78.63,60.65 C79.2 80.26,60.82 R2.2
$1N15429: length 3.6
  Bottom Layer w0.254: 78.76,59.38 C79.1
  Bottom Layer w0.381: 76.97,59.38 78.76,59.38 ; C79.1 80.26,59.42 R3.2
$1N15433: length 6
  Bottom Layer w0.254: U1.3 81.63,58.89 R3.1 81.29,56.89 C80.2 83.81,56.89 R4.2
$1N15437: length 7.9
  Bottom Layer w0.254: R5.2 84.24,58.72 U1.1 84.07,59.49 83.06,60.5 83.06,62.28 C94.1 83.62,62.84 R81.2
$1N15439: length 1.4
  Bottom Layer w0.254: FB2.2 84.92,61.09 U1.5
$1N15450: length 5.1
  Bottom Layer w0.254: C95.2 82.3,53.14 R80.1 ; C95.2 82.17,51.39 U21.4 ; C95.2 82.28,51.53 R68.1
$1N15452: length 3.8
  Bottom Layer w0.381: 76.98,50.01 78.99,50.01 79.13,49.87 80.56,49.87 80.71,50.03
$1N15453: length 3.9
  Bottom Layer w0.381: 76.98,48.74 78.82,48.74 79.09,48.47 80.47,48.47 80.71,48.23
$1N15457: length 6.4
  Bottom Layer w0.254: R69.1 80.65,46.66 80.65,45.77 80.99,45.43 C89.2 83.87,45.43 R70.2 ; 82.3,47.65 81.38,46.72 80.71,46.72
$1N15461: length 8
  Bottom Layer w0.254: R80.2 83.75,51.57 83.7,51.52 83.7,51.24 83.06,50.6 83.06,49.2 84.07,48.18 U21.1 85.76,47.65 R72.2
$1N15463: length 1.7
  Bottom Layer w0.254: U21.5 84.47,49.85 84.89,50.27 85.6,50.27
$1N23607: length 2
  Top Layer w0.254: 24.15,83.99 24.15,84 LED11.1

## Copper pours and planes (outline as drawn; the poured copper is in the pictures)
5V1 on Top Layer: 30.35,58.34 29.84,58.34 28.83,57.33 28.83,50.72 28.57,50.47 26.92,50.47 26.42,50.98 26.42,53.26 26.03,53.64 20.32,53.64 19.94,54.03 19.94,55.68 19.43,56.19 19.43,57.84 18.87,58.4 17.29,58.4 17.02,58.67 17.02,60.25 16.24,61.01 10.16,61.01 10.03,61.14 10.03,61.52 10.29,61.77 14.22,61.77 16.38,63.93 16.38,74.73 13.08,78.03 11.81,78.03 11.56,78.28 2.29,78.28 1.91,78.66 1.91,80.18 2.37,80.65 13.64,80.65 14.22,80.07 19.43,75.26 19.43,60.76 19.56,60.63 23.37,60.63 24.51,59.49 30.35,59.49 30.58,59.26 30.58,58.57
+3V3 on Top Layer: 2.15,87.65 1.65,87.15 1.65,85.52 2.16,85.01 13.59,85.01 14.35,85.78 14.35,86.92 13.62,87.65
+3V3 on Top Layer: 90.54,27.25 90.3,27.01 90.3,26.21 90.42,26.09 91.43,26.09 91.59,25.93 91.59,19.76 91.44,19.61 91.44,19.48 90.55,19.48 90.3,19.23 90.3,18.47 90.42,18.34 91.57,18.34 91.69,18.21 91.69,13.39 90.04,11.74 90.04,11.23 90.42,10.85 91.31,10.85 92.71,12.24 92.71,26.59 92.05,27.25
+12V on Top Layer: 2.29,73.58 1.91,73.2 1.91,71.3 2.29,70.92 13.84,70.92 14.22,71.3 14.22,72.95 13.59,73.58
+12V on Top Layer: 5.97,47.17 6.35,46.79 7.72,46.79 7.92,46.99 7.87,51.61 8.78,52.74 8.78,53.52 8.64,53.64 7.76,53.64 5.97,51.61
AGND on Bottom Layer: 65.41,51.61 65.28,51.49 65.28,49.83 65.41,49.71 66.77,49.71 66.93,49.87 66.93,51.49 66.8,51.61
AGND on Bottom Layer: 65.41,62.28 65.28,62.15 65.28,60.63 65.53,60.38 66.8,60.38 66.93,60.5 66.93,62.03 66.68,62.28
AGND on Bottom Layer: 67.69,56.57 67.56,56.44 67.56,53.77 67.82,53.52 68.33,53.52 68.58,53.77 68.58,56.31 68.33,56.57
AGND on Bottom Layer: 67.36,45.95 67.06,45.64 67.06,42.98 67.18,42.85 68.83,42.85 68.96,42.98 68.96,45.64 68.66,45.95
AGND on Inner2: 7.11,106.1 -2.67,96.32 -2.67,62.53 -0.13,65.08 -0.13,65.2 1.78,63.3 54.86,63.3 56.77,61.39 56.77,42.98 58.8,40.94 70.23,40.94 71.75,42.7 71.75,62.28 80.52,71.04 98.55,71.04 102.36,74.85 102.36,99.49 95.76,106.1
AGND1 on Inner2: 1.65,60.63 31.12,60.25 34.03,57.45 34.16,33.57 37.84,30.02 73.15,29.64 74.55,31.04 74.55,60.88 79.38,65.71 99.31,65.71 104.01,61.01 104.01,-2.74 98.55,-8.2 -4.32,-8.2 -4.32,54.66
GND1 on Top Layer: 20.57,97.11 20.57,83.36 20.45,83.24 19.3,83.24 18.42,84.12 18.42,87.68 15.75,90.35 15.75,96.7 16.51,97.46 20.27,97.46
GND1 on Top Layer: 12.95,48.01 12.95,53.14 12.3,53.79 7.67,53.79 7.62,53.84 7.62,56.06 8.13,56.57 13.97,56.57 14.35,56.95 14.35,59.87 14.86,60.38 16.26,60.38 16.64,60 16.64,58.47 16,57.84 16,47.68 15.59,47.27 13.7,47.27
GND1 on Top Layer: 30.99,61.14 30.86,61.01 30.86,60.9 30.94,60.76 31.5,60.76 31.62,60.63 31.62,60.25 31.75,60.12 32.38,60.12 32.38,61.01 32.77,61.39 35.1,61.39 35.38,61.67 35.38,62.35 35.31,62.41 34.42,62.41 33.78,61.77 32,61.77 31.62,61.39 31.62,61.27 31.5,61.14
GND1 on Top Layer: 22.35,65.71 22.35,62.28 22.61,62.03 25.53,62.03 27.56,60 30.13,60 30.23,60.11 30.23,60.91 29.99,61.14 29.08,61.14 24.21,65.96 22.61,65.96
GND1 on Top Layer: 3.6,39.06 2.79,38.25 2.79,30.15 3.81,29.13 9.97,29.13 10.8,29.92 10.8,32.44 9.65,33.58 7.95,33.58 6.98,34.7 6.98,37.52 5.44,39.06
GND1 on Inner1: -8.76,111.43 112.78,111.43 112.78,-6.04 -8.76,-6.04
$1N23729 on Top Layer: 6.48,46.53 6.1,46.15 6.1,45.26 6.6,44.75 7.49,44.75 9.53,42.72 9.53,34.59 10.16,33.96 10.92,33.96 11.56,34.59 11.56,42.85 7.87,46.53

Small or netless copper shapes (teardrops, artwork), in the pictures only: 123 on Top Layer, 138 on Bottom Layer, 12 on Inner1

## Text on the board
Top Silkscreen Layer: GND | A0 | A1 | B0 | B1 | PWM1A | PWM3A | PWM5A | PWM1B | PWM3B | PWM5B | +12V | PWM2B | PWM4B | PWM6B | PWM2A | PWM4A | PWM6A | AGND | 200V | 400V | 12V | 5V | 3V3
